# Altium project EPS 2023-24.PrjPcb
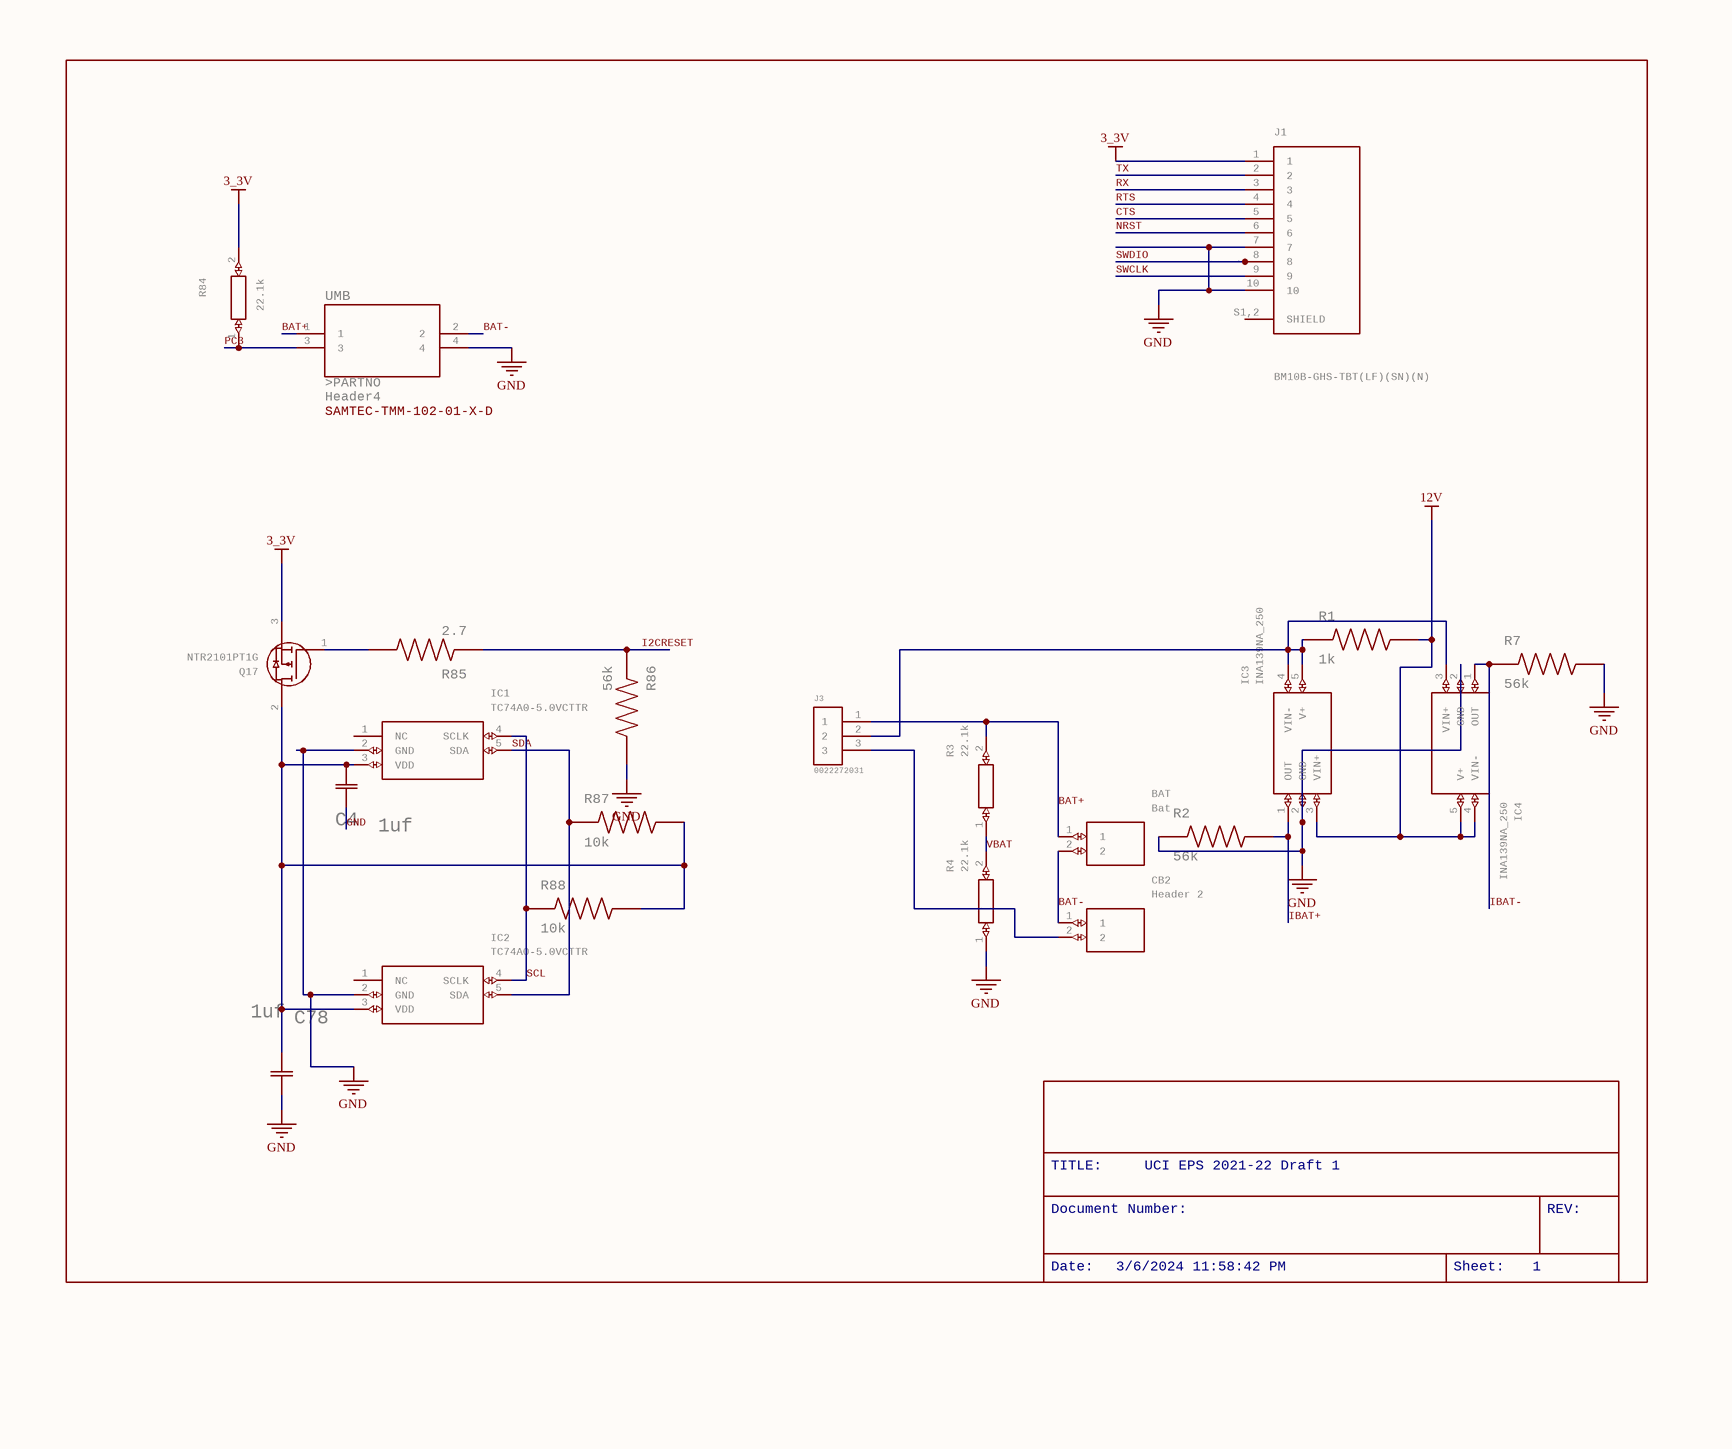
[diagram p0: EPS_Headers.SchDoc]
7 sheets, 258 parts. Net scope: flat (ports and power ports of the same name join across sheets).
Board file: EPS 2023-24.PcbDoc
Sheets:
  EPS_Headers.SchDoc
  SolarPanel_PowerGeneration.SchDoc
  Voltage_BypassCapacitors.SchDoc
  PAH_Deployments.SchDoc
  System_VoltageControl.SchDoc
  STM32_IO.SchDoc
  TEST_SchematicHierarchy.SchDoc

## Sheet EPS_Headers.SchDoc: UCI EPS 2021-22 Draft 1
size 304 x 254 mm; Origin: Eagle; Date: 3/6/2024 11:58:42 PM; SheetNumber: 1; GateName_1: G$1; SymbolName_1: FRAME_A_L; LibraryName: frames; DeviceSetName: FRAME_A_L; GateName_2: G$2; SymbolName_2: DOCFIELD; Sheet: Sheet:; REV: REV:

### Parts
BAT  Bat  [SHDR2W64P0X254_1X2_508X580X117]
C4  1uf  [YAG_CC0603_YAG-L]
C78  1uf  [YAG_CC0603_YAG]
CB2  Header 2  [SHDR2W64P0X254_1X2_508X580X117]
IC1  TC74A0-5.0VCTTR  [SOT95P280X145-5N]
IC2  TC74A0-5.0VCTTR  [SOT95P280X145-5N]
IC3  INA139NA_250  [SOT95P280X145-5N]
IC4  INA139NA_250  [SOT95P280X145-5N]
J1  BM10B-GHS-TBT(LF)(SN)(N)  [JST_BM10B-GHS-TBT(LF)(SN)(N)]
J3  0022272031  [MOLEX_0022272031]
Q17  NTR2101PT1G  [SOT96P237X111-3N]
R1  1k  [RESC1608X55N]
R2  56k  [RESC1608X55N]
R3  22.1k  [RESC1608X55N]
R4  22.1k  [RESC1608X55N]
R7  56k  [RESC1608X55N]
R84  22.1k  [RESC1608X55N]
R85  2.7  [RESC1608X55N]
R86  56k  [RESC1608X55N]
R87  10k  [RESC1608X55N]
R88  10k  [RESC1608X55N]
UMB  Header4  PARTNO: >PARTNO  [SAMTEC-TMM-102-01-X-D]

### Nets
3_3V: J1.1 Q17.3(D) R84.2
12V: IC3.3(VIN+) IC4.4(VIN-) IC4.5(V+) R1.2
GND: C4.1 C78.2 IC1.2(GND) IC2.2(GND) IC3.2(GND) IC4.2(GND) J1.7 J1.10 R2.1 R4.1 R7.2 R86.2 UMB.4  [project net BOTTOM]
BAT+: BAT.1 J3.1 R3.2 UMB.1  [project net BAT+_1]
BAT-: BAT.2 CB2.1 UMB.2  [project net BAT-_1]
CTS: J1.5  [project net CTS_1]
I2CRESET: R85.1 R86.1  [project net I2CRESET_1]
IBAT+: IC3.1(OUT) R2.2  [project net IBAT+_1]
IBAT-: IC4.1(OUT) R7.1  [project net IBAT-_1]
NRST: J1.6  [project net NRST_1]
PC3: R84.1 UMB.3  [project net PC3_1]
RTS: J1.4  [project net RTS_1]
RX: J1.3  [project net RX_1]
SCL: IC1.4(SCLK) IC2.4(SCLK) R88.1  [project net SCL_1]
SDA: IC1.5(SDA) IC2.5(SDA) R87.1  [project net SDA_1]
SWCLK: J1.9  [project net SWCLK_1]
SWDIO: J1.8  [project net SWDIO_1]
TX: J1.2  [project net TX_1]
VBAT: R3.1 R4.2  [project net VBAT_1]
NetC4_2: C4.2 C78.1 IC1.3(VDD) IC2.3(VDD) Q17.2(S) R87.2 R88.2
NetCB2_2: CB2.2 J3.3
NetIC3_4: IC3.4(VIN-) IC3.5(V+) IC4.3(VIN+) J3.2 R1.1
NetQ17_1: Q17.1(G) R85.2

Not connected (* = marked no-connect by the designer): IC1 1(NC); IC2 1(NC); J1 S1,2(SHIELD)

### Notes on the sheet
- TITLE:
- UCI EPS 2021-22 Draft 1
- Document Number:
- REV:
- Date:
- 3/6/2024 11:58:42 PM
- Sheet:
- 1

### Library data of the parts
BAT CB2 = 0022272021: Conn Wire to Board HDR 2 POS 2.54mm Solder ST Thru-Hole KK Bag   Source:  Datasheet; MANUFACTURER_NAME: Molex; GateName_1: G$1; SymbolName_1: 0022272021; LibraryName: header 2; DeviceSetName: 0022272021; ARROW_PART_NUMBER: 0022272021; ARROW_PRICE-STOCK: https://www.arrow.com/en/products/0022272021/molex; HEIGHT: 11.7mm; MANUFACTURER_PART_NUMBER: 0022272021; MOUSER_PART_NUMBER: N/A; MOUSER_PRICE-STOCK: https://www.mouser.co.uk/ProductDetail/Molex/0022272021?qs=PBcRNPEHKsoTuJ7eDXMaUA%3D%3D
C4 = CC0603KRX7R7BB105YAG_CC0603_YAG-L: GateName_1: A; SymbolName_1: CAPH; BUILT_BY: EMA_UL_Team; SOURCELIBRARY: Yageo_2014-12-31; VENDOR: Yageo; DeviceName: YAG_CC0603_YAG-L; LibraryName: Cap 1uf; DeviceSetName: CC0603KRX7R7BB105; MANUFACTURER_PART_NUMBER: CC0603KRX7R7BB105
C78 = CC0603KRX7R7BB105: GateName_1: A; SymbolName_1: CAPH; BUILT_BY: EMA_UL_Team; SOURCELIBRARY: Yageo_2014-12-31; VENDOR: Yageo; LibraryName: Cap 1uf; DeviceSetName: CC0603KRX7R7BB105; MANUFACTURER_PART_NUMBER: CC0603KRX7R7BB105
IC1 IC2 = TC74A0-5.0VCTTR: Serial Digital Thermal Sensor   Source:  Datasheet; MANUFACTURER_NAME: Microchip; GateName_1: G$1; SymbolName_1: TC74A0-5.0VCTTR; LibraryName: TC74A0-5.0VCTTR; DeviceSetName: TC74A0-5.0VCTTR; ARROW_PART_NUMBER: TC74A0-5.0VCTTR; ARROW_PRICE-STOCK: https://www.arrow.com/en/products/tc74a0-5.0vcttr/microchip-technology; HEIGHT: 1.45mm; MANUFACTURER_PART_NUMBER: TC74A0-5.0VCTTR; MOUSER_PART_NUMBER: 579-TC74A0-5.0VCTTR; MOUSER_PRICE-STOCK: https://www.mouser.co.uk/ProductDetail/Microchip-Technology/TC74A0-50VCTTR?qs=RnzODY3cU8u6j2kV6CfePA%3D%3D
IC3 IC4 = INA139NA_250: 36V, High-Side, High-Speed, Current Output Current Sense Amplifier   Source:  Datasheet; MANUFACTURER_NAME: Texas Instruments; MANUFACTURER_PART_NUMBER: INA139NA/250; GateName_1: G$1; SymbolName_1: INA139NA_250; LibraryName: INA139NA_250; DeviceSetName: INA139NA_250; ARROW_PART_NUMBER: INA139NA/250; ARROW_PRICE-STOCK: https://www.arrow.com/en/products/ina139na250/texas-instruments; HEIGHT: 1.45mm; MOUSER_PART_NUMBER: 595-INA139NA/250; MOUSER_PRICE-STOCK: https://www.mouser.co.uk/ProductDetail/Texas-Instruments/INA139NA-250?qs=VBduBm9rCJQSYOixXF05Zw%3D%3D
J1 = BM10B-GHS-TBT(LF)(SN)(N): Connector Header Surface Mount 10 position 0.049" (1.25mm) Check prices; GateName_1: G$1; MF: JST Sales; SymbolName_1: BM10B-GHS-TBT(LF)(SN)(N); LibraryName: BM10B-GHS-TBT_LF__SN__N_; DeviceSetName: BM10B-GHS-TBT(LF)(SN)(N); AVAILABILITY: Not in stock; MP: BM10B-GHS-TBT(LF)(SN)(N); PACKAGE: None; PRICE: None
J3 = 0022272031: CONN HEADER 3POS .100 VERT TIN Check prices; GateName_1: G$1; MF: Molex; SymbolName_1: 0022272031; LibraryName: header 3; DeviceSetName: 0022272031; AVAILABILITY: Good; MP: 0022272031; PACKAGE: None; PRICE: None
Q17 = NTR2101PT1G: Small Signal MOSFET   Source:  Datasheet; MANUFACTURER_NAME: ON Semiconductor; GateName_1: G$1; SymbolName_1: NTR2101PT1G; LibraryName: MOSFET-P; DeviceSetName: NTR2101PT1G; ARROW_PART_NUMBER: NTR2101PT1G; ARROW_PRICE-STOCK: https://www.arrow.com/en/products/ntr2101pt1g/on-semiconductor; HEIGHT: 1.11mm; MANUFACTURER_PART_NUMBER: NTR2101PT1G; MOUSER_PART_NUMBER: 863-NTR2101PT1G; MOUSER_PRICE-STOCK: https://www.mouser.co.uk/ProductDetail/ON-Semiconductor/NTR2101PT1G?qs=ZXBb0xZ9WeAElbwG%2FHcx4g%3D%3D
R1 = ERJ-PB3D1001V: Res Thick Film 0603 1K Ohm 5% 0.2W(1/5W) Â±50ppm/C Pad SMD Automotive T/R; GateName_1: G$1; MF: Panasonic; SymbolName_1: ERJ-PB3D1001V; LibraryName: Res1 1k; DeviceSetName: ERJ-PB3D1001V; DIGI-KEY_PART_NUMBER: P20283CT-ND; MP: ERJ-PB3D1001V; PACKAGE: 1608 Panasonic Electronic Components
R2 R7 R86 = ERJ-PB3D5602V: RES SMD 56K OHM 0.5% 1/5W 0603; GateName_1: G$1; MF: Panasonic; SymbolName_1: ERJ-PB3D5602V; LibraryName: Res1 56k; DeviceSetName: ERJ-PB3D5602V; DIGI-KEY_PART_NUMBER: DIGI-KEY_PART_NUMBER; MP: ERJ-PB3D5602V; PACKAGE: 1608 Panasonic Electronic Components
R3 R4 R84 = ERJPB3D2212V: hj   Source:  Datasheet; MANUFACTURER_NAME: Panasonic; GateName_1: G$1; SymbolName_1: ERJPB3D2212V; LibraryName: Res1-22.1k; DeviceSetName: ERJPB3D2212V; ARROW_PART_NUMBER: ARROW_PART_NUMBER; ARROW_PRICE-STOCK: ARROW_PRICE-STOCK; HEIGHT: 0.55mm; MANUFACTURER_PART_NUMBER: ERJPB3D2212V; MOUSER_PART_NUMBER: MOUSER_PART_NUMBER; MOUSER_PRICE-STOCK: MOUSER_PRICE-STOCK
R85 = RL0816S-2R7-F: GateName_1: G$1; MF: Susumu; SymbolName_1: RL0816S-2R7-F; LibraryName: Res1-2.7; DeviceSetName: RL0816S-2R7-F; DIGI-KEY_PART_NUMBER: DIGI-KEY_PART_NUMBER; MP: RL0816S-2R7-F; PACKAGE: 1608 Susumu
R87 R88 = ERJ-PB3D1002V: Res Thick Film 0603 10K Ohm 5% 0.2W(1/5W) Â±50ppm/C Pad SMD Automotive T/R; GateName_1: G$1; MF: Panasonic Electronic; SymbolName_1: ERJ-PB3D1002V; LibraryName: Res1 10k; DeviceSetName: ERJ-PB3D1002V; DIGI-KEY_PART_NUMBER: DIGI-KEY_PART_NUMBER; MP: ERJ-PB3D1002V; PACKAGE: 1608 Panasonic Electronic Components
UMB = SAMTEC-TMM-102-01-X-DJ: Check prices; GateName_1: A; SymbolName_1: SAMTEC-TMM-102-01-X-DA; DeviceName: J; MF: Samtec Inc.; MP: TMM-102-01-T-D; LibraryName: 4 pin header replace; DeviceSetName: SAMTEC-TMM-102-01-X-D; SAMTEC-TMM-102-01-X-D: SAMTEC-TMM-102-01-X-D; AVAILABILITY: In Stock; PACKAGE: None; PRICE: None; PURCHASE-URL: https://pricing.snapeda.com/search/part/TMM-102-01-T-D/?ref=eda

## Sheet SolarPanel_PowerGeneration.SchDoc
size 690 x 406 mm; Origin: Eagle
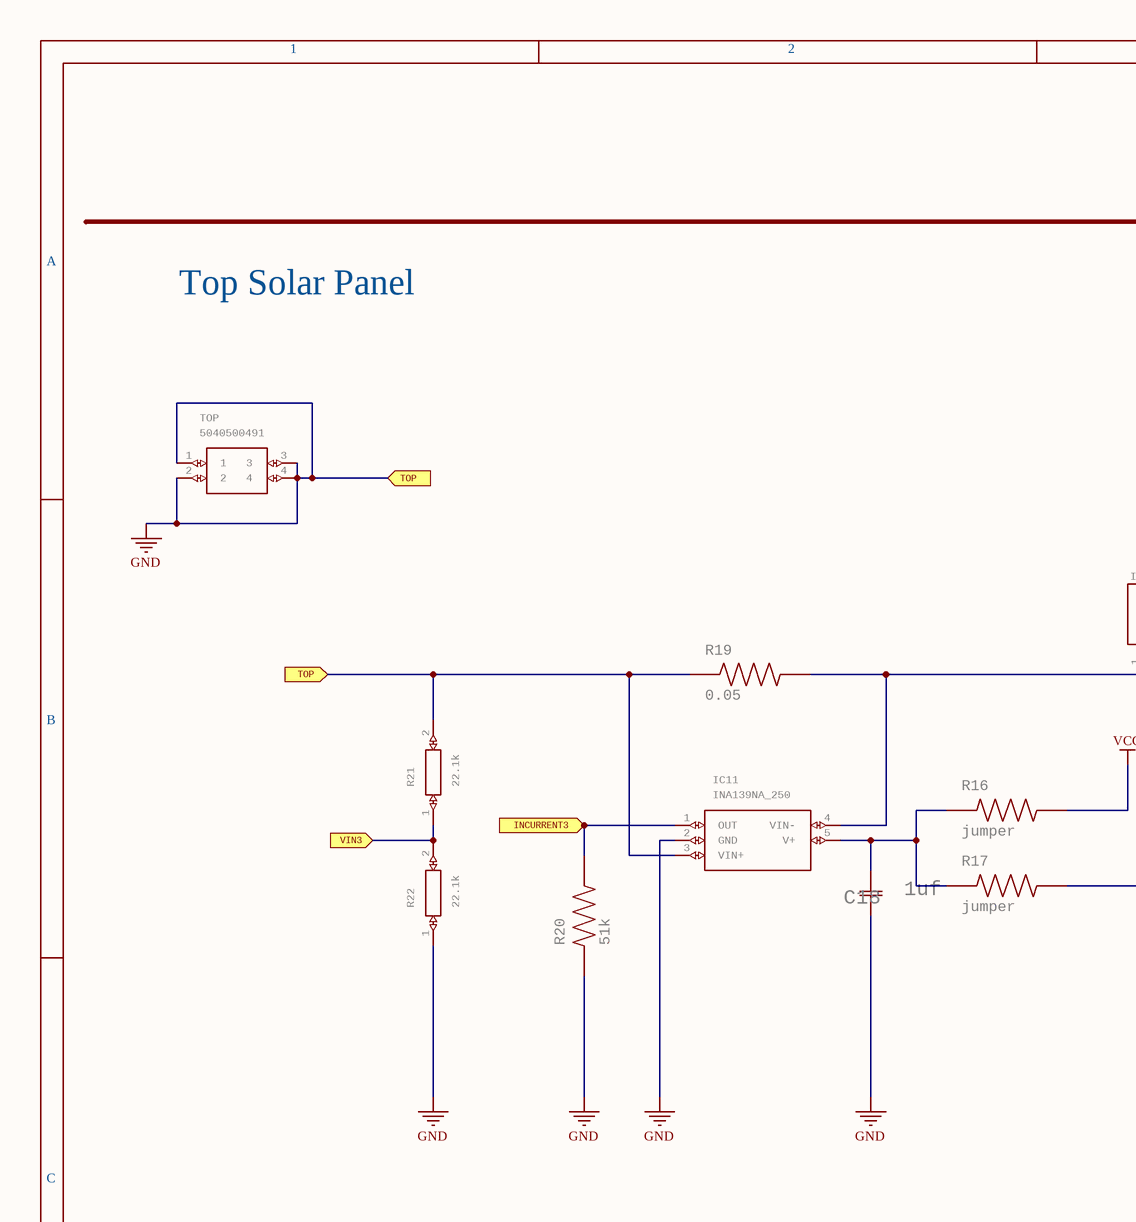
[diagram p1: SolarPanel_PowerGeneration.SchDoc, top left]
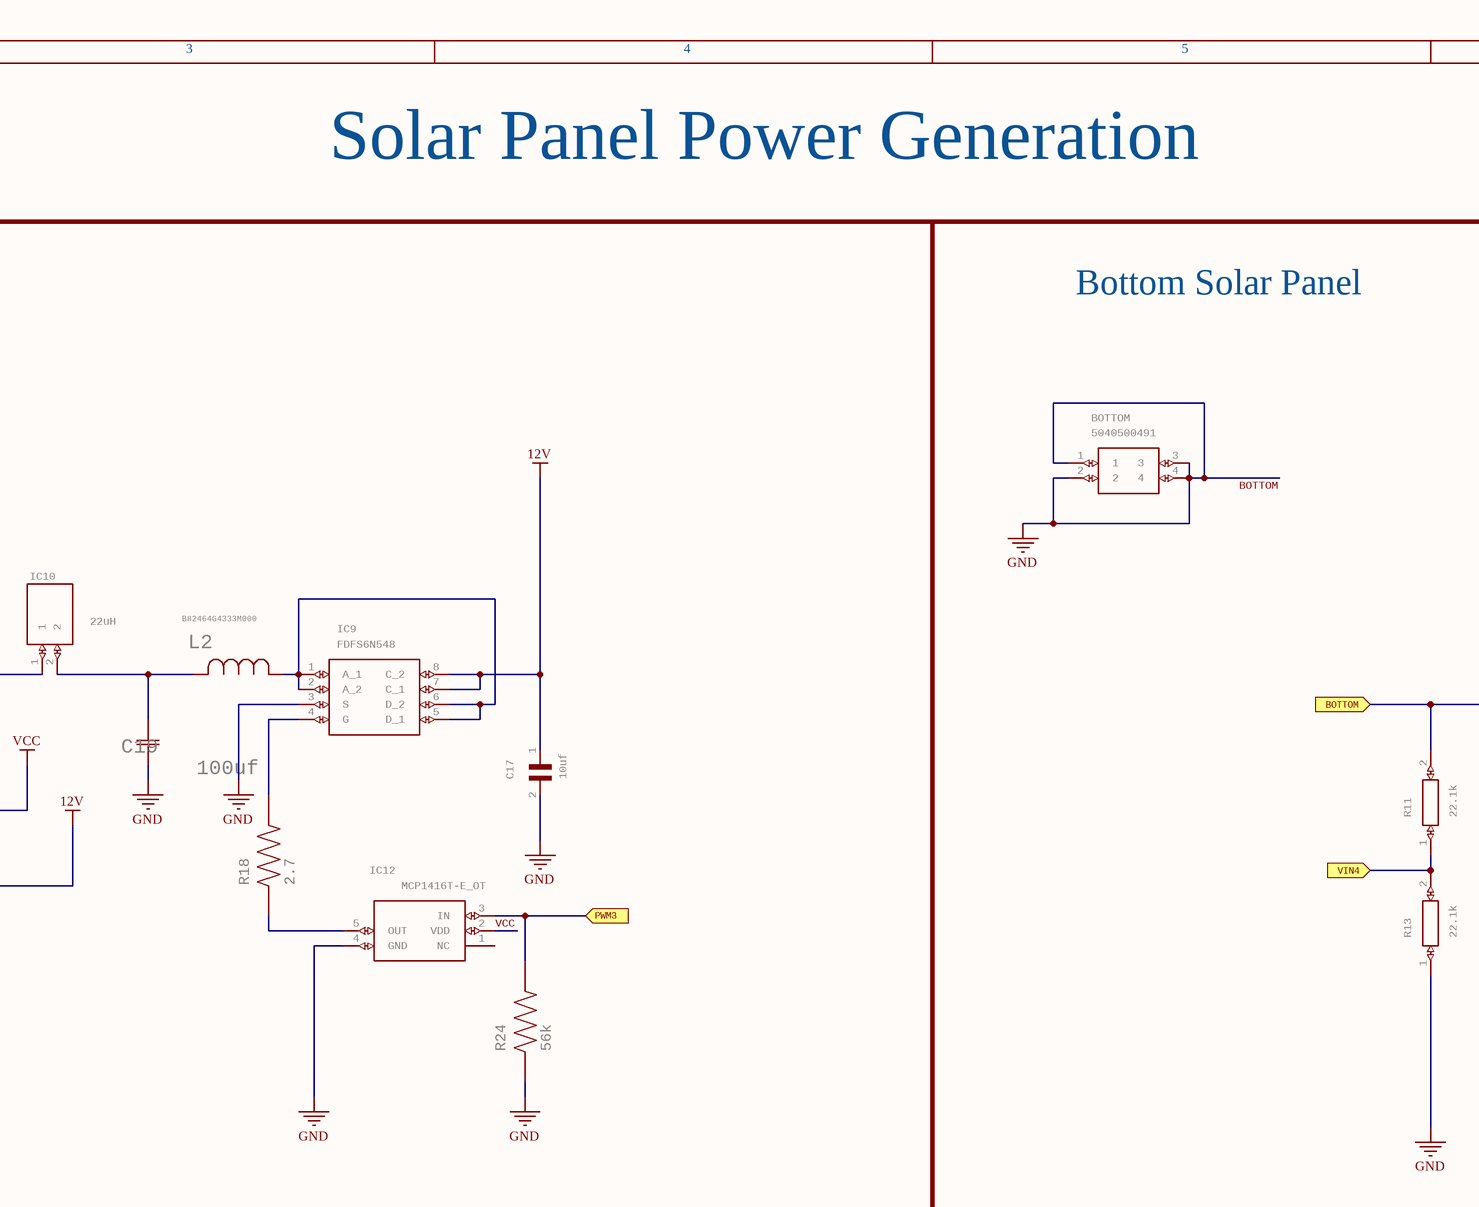
[diagram p2: SolarPanel_PowerGeneration.SchDoc, top middle]
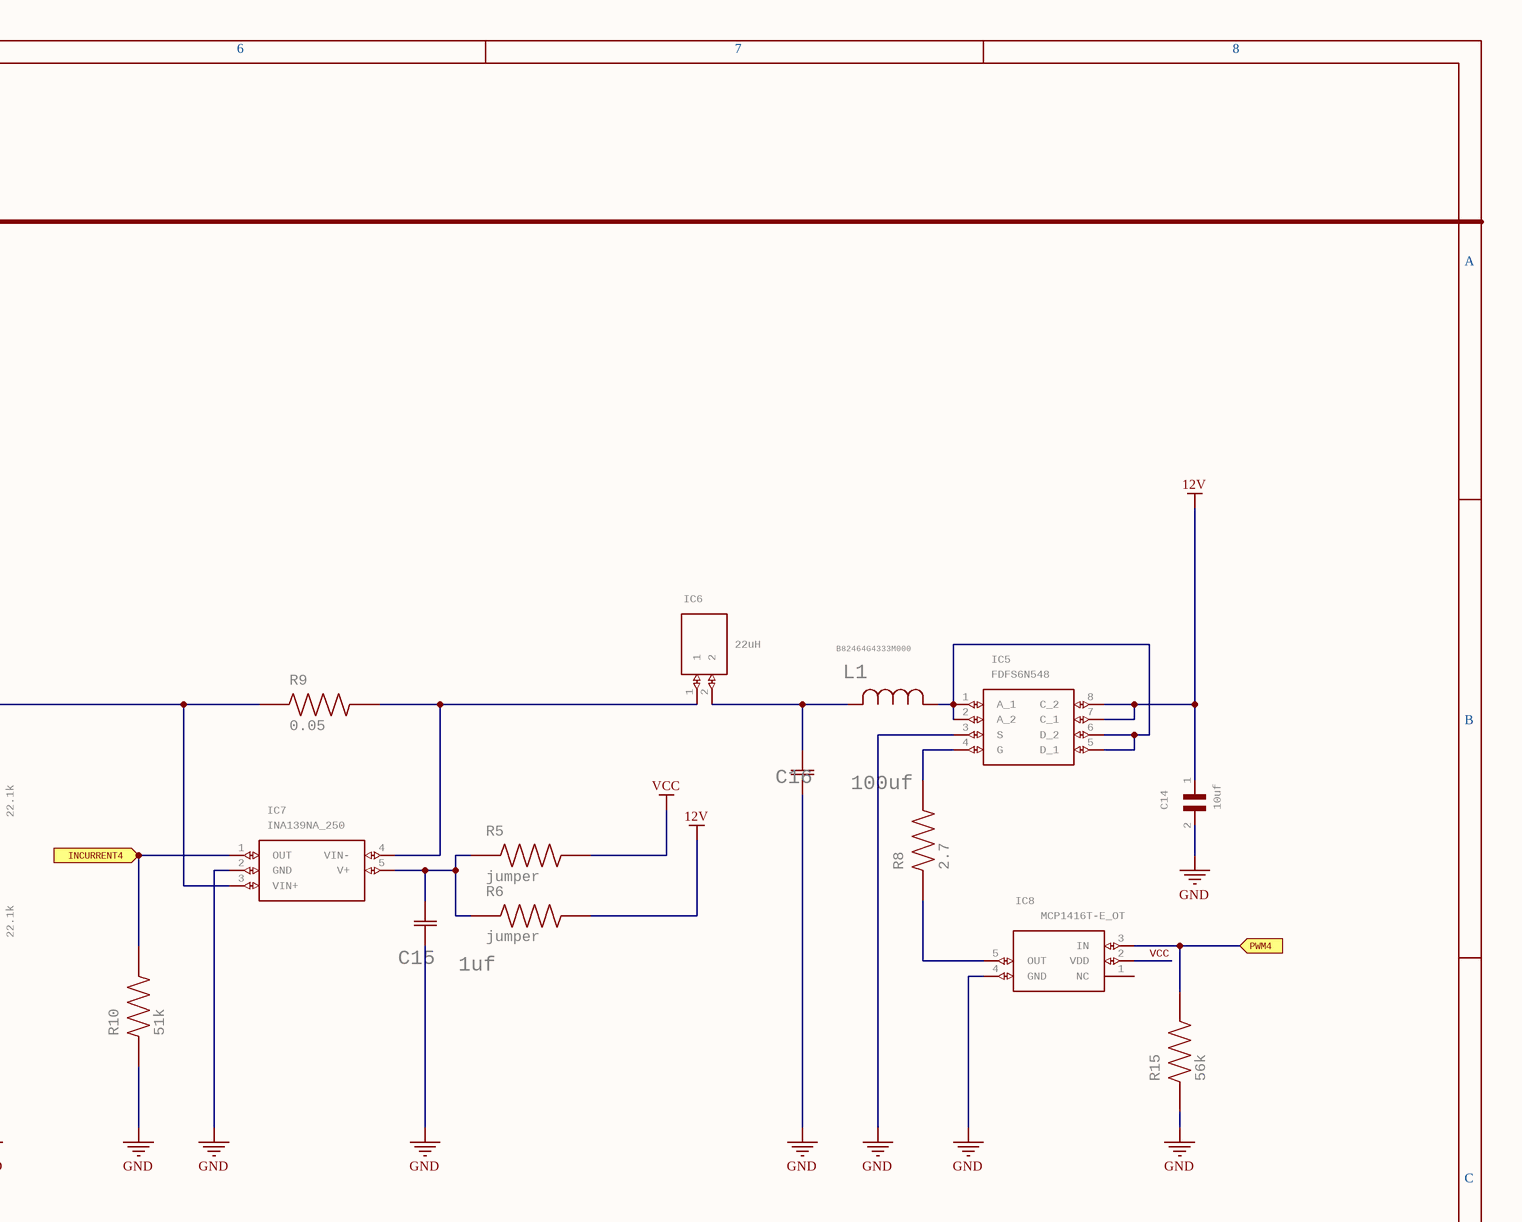
[diagram p3: SolarPanel_PowerGeneration.SchDoc, top right]
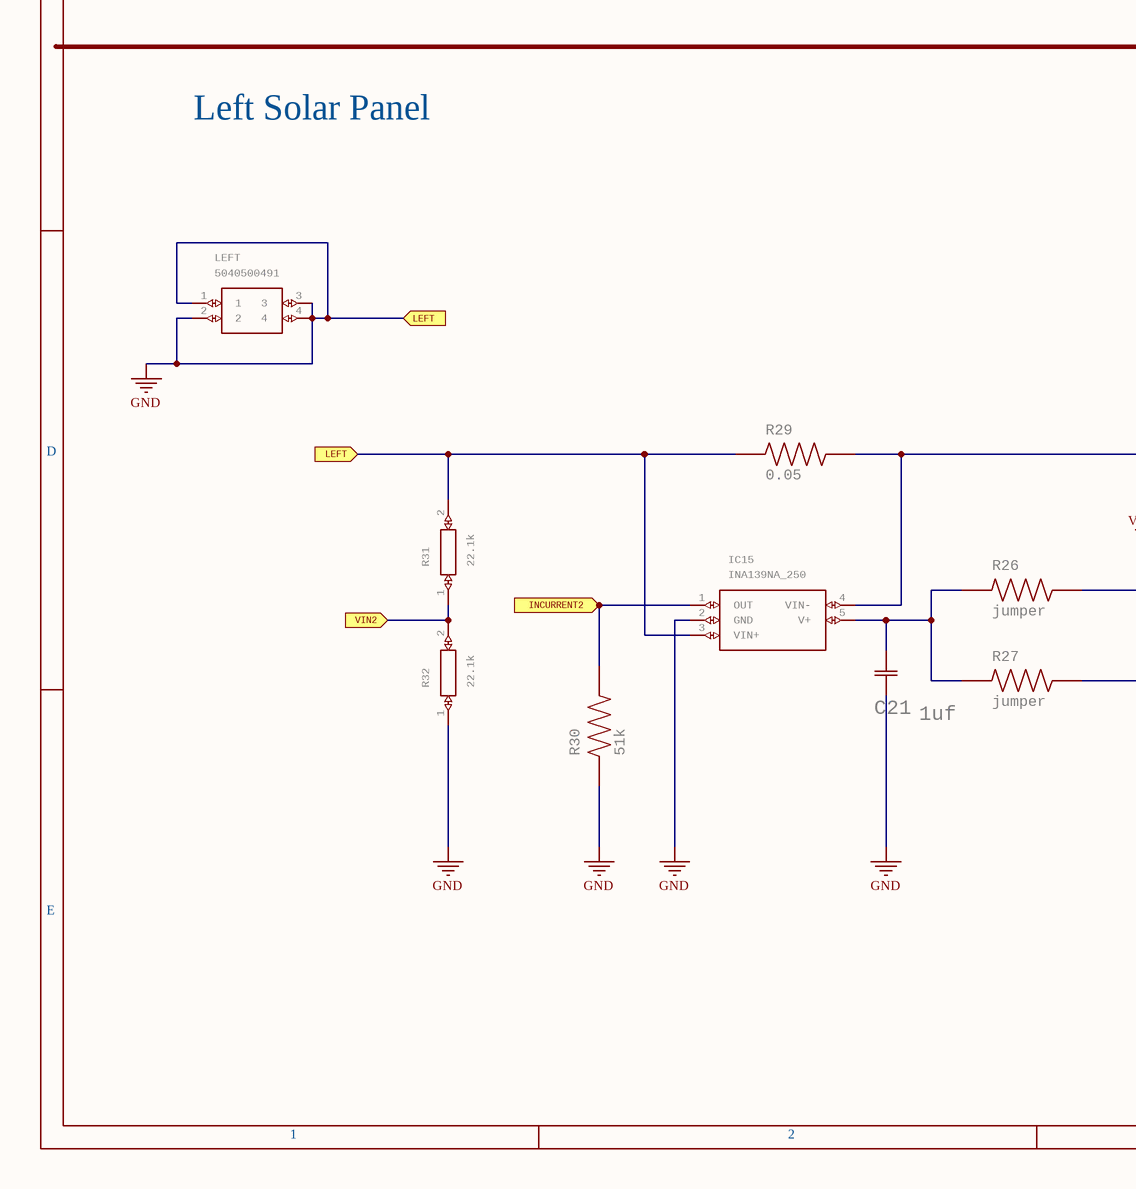
[diagram p4: SolarPanel_PowerGeneration.SchDoc, bottom left]
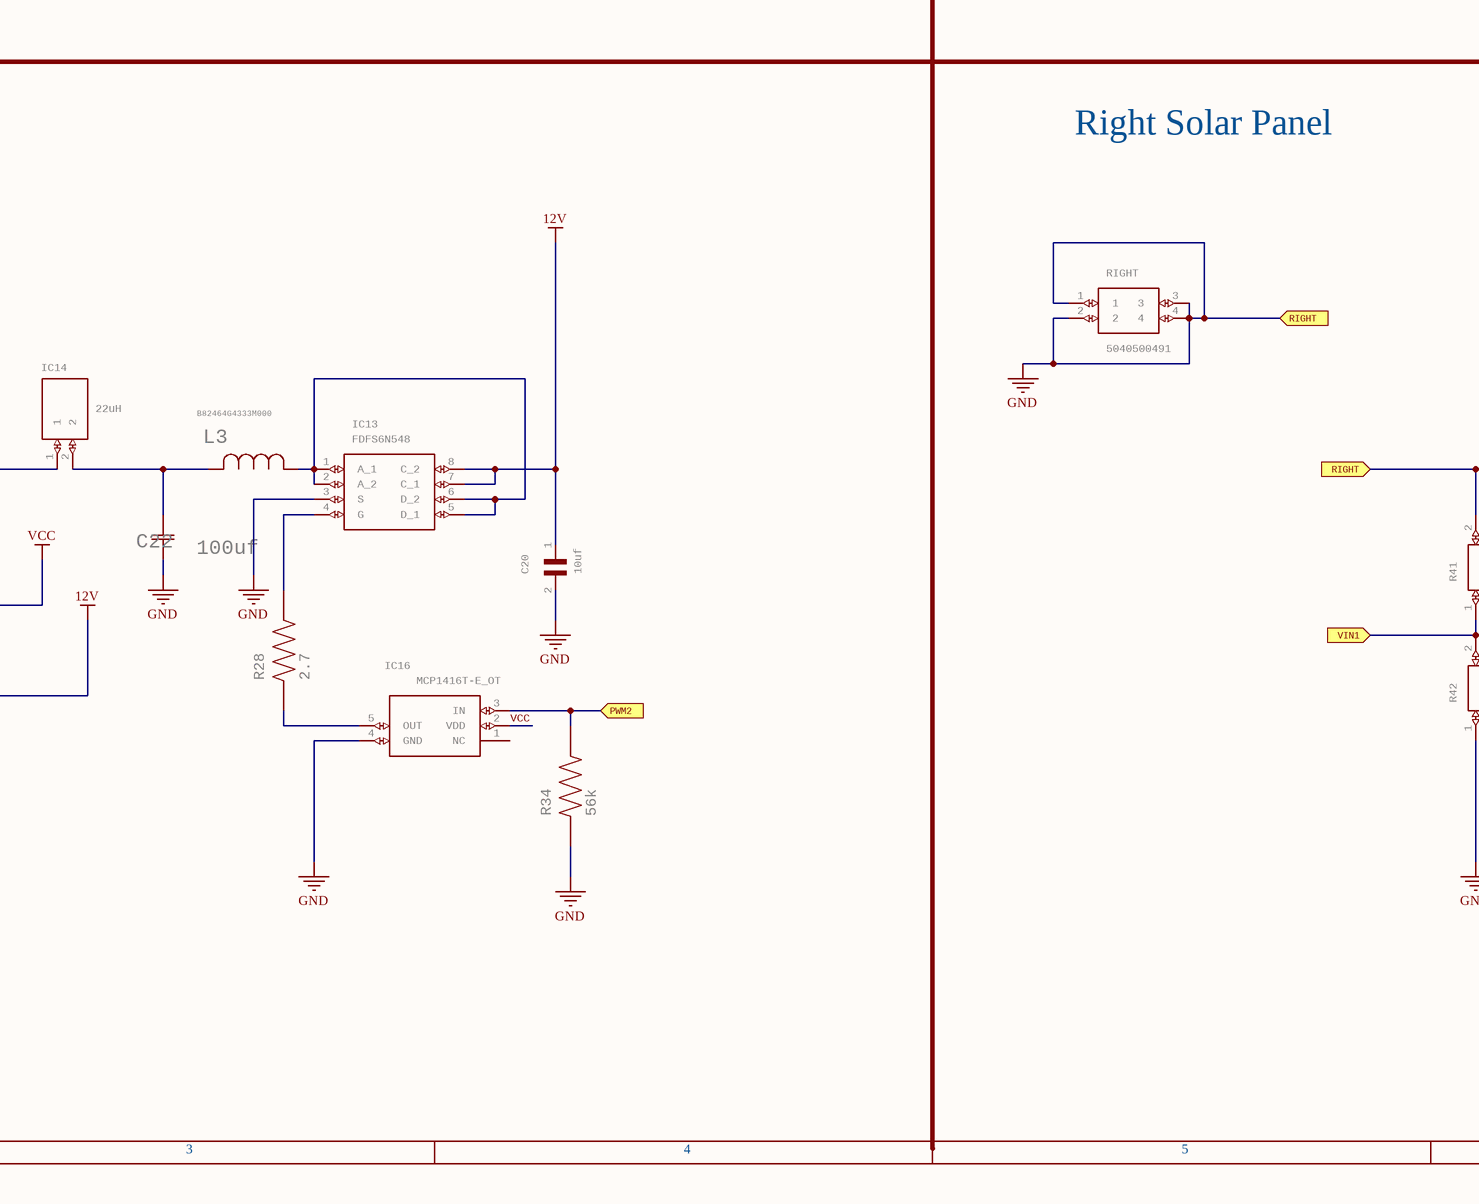
[diagram p5: SolarPanel_PowerGeneration.SchDoc, bottom middle]
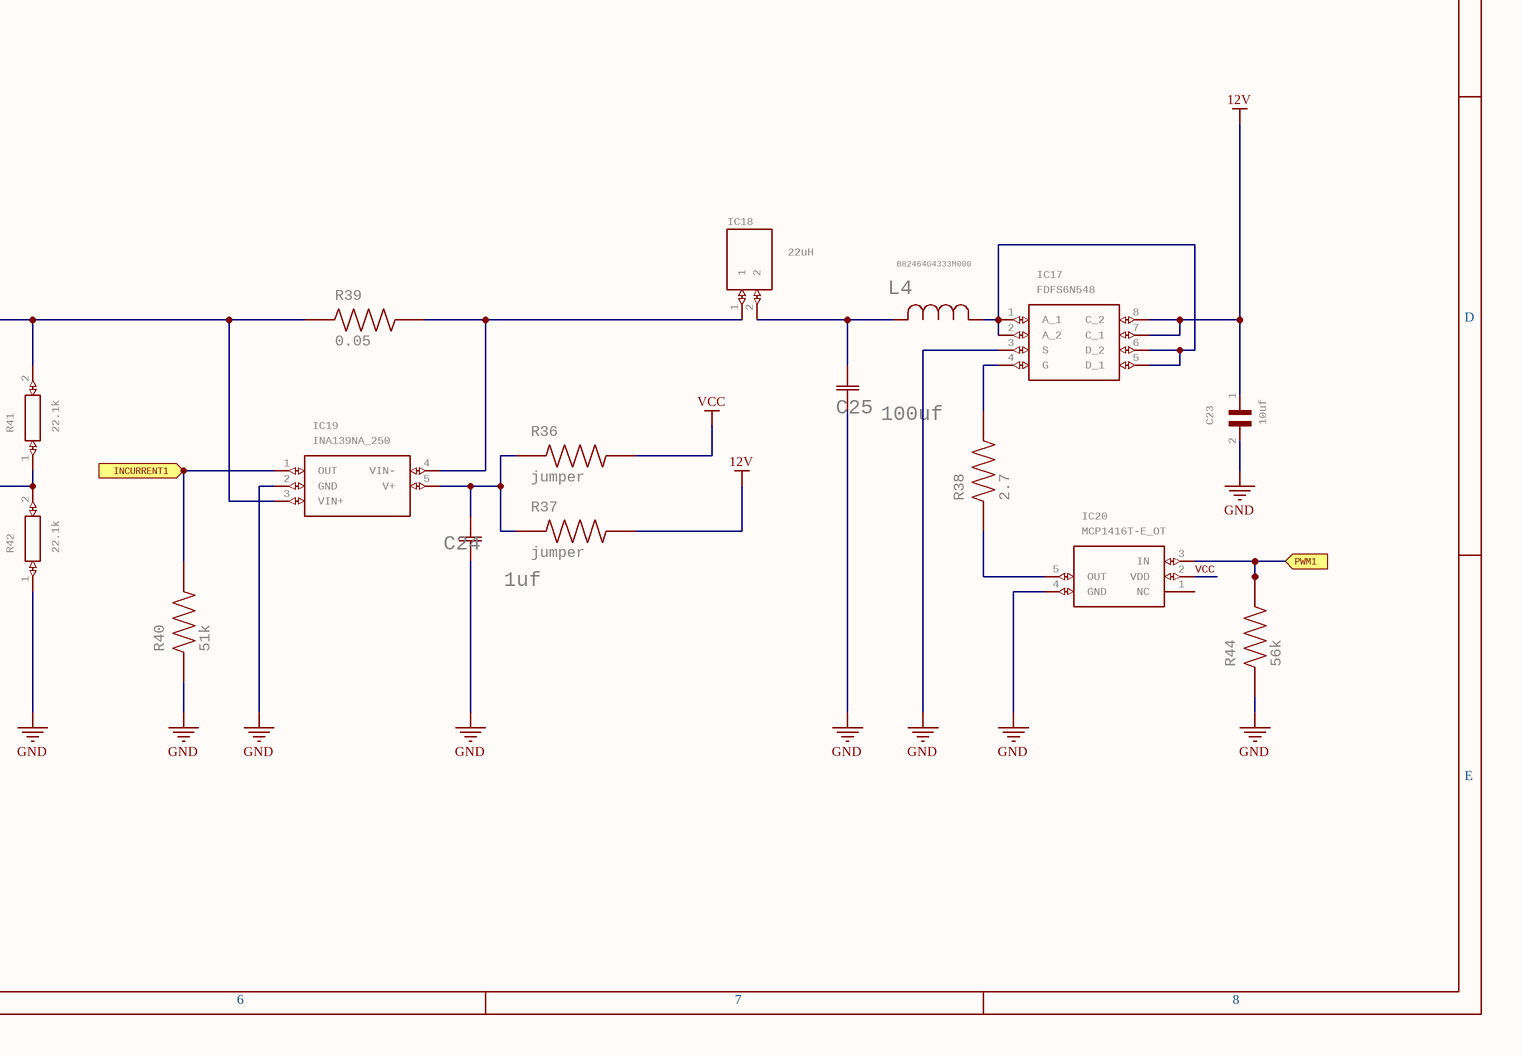
[diagram p6: SolarPanel_PowerGeneration.SchDoc, bottom right]

### Parts
BOTTOM  5040500491  [5040500491]
C14  10uf  [CAPC2012X70]
C15  1uf  [YAG_CC0603_YAG]
C16  100uf  [CAP_CC1210_YAG]
C17  10uf  [CAPC2012X70]
C18  1uf  [YAG_CC0603_YAG]
C19  100uf  [CAP_CC1210_YAG]
C20  10uf  [CAPC2012X70]
C21  1uf  [YAG_CC0603_YAG]
C22  100uf  [CAP_CC1210_YAG]
C23  10uf  [CAPC2012X70]
C24  1uf  [YAG_CC0603_YAG]
C25  100uf  [CAP_CC1210_YAG]
IC5  FDFS6N548  [SOIC127P600X175-8N]
IC6  22uH  [SRU8043220Y]
IC7  INA139NA_250  [SOT95P280X145-5N]
IC8  MCP1416T-E_OT  [SOT95P270X145-5N]
IC9  FDFS6N548  [SOIC127P600X175-8N]
IC10  22uH  [SRU8043220Y]
IC11  INA139NA_250  [SOT95P280X145-5N]
IC12  MCP1416T-E_OT  [SOT95P270X145-5N]
IC13  FDFS6N548  [SOIC127P600X175-8N]
IC14  22uH  [SRU8043220Y]
IC15  INA139NA_250  [SOT95P280X145-5N]
IC16  MCP1416T-E_OT  [SOT95P270X145-5N]
IC17  FDFS6N548  [SOIC127P600X175-8N]
IC18  22uH  [SRU8043220Y]
IC19  INA139NA_250  [SOT95P280X145-5N]
IC20  MCP1416T-E_OT  [SOT95P270X145-5N]
L1  B82464G4333M000  [IND_B82464G4_EPC]
L2  B82464G4333M000  [IND_B82464G4_EPC]
L3  B82464G4333M000  [IND_B82464G4_EPC]
L4  B82464G4333M000  [IND_B82464G4_EPC]
LEFT  5040500491  [5040500491]
R5  jumper  [RESC1508X50N]
R6  jumper  [RESC1508X50N]
R8  2.7  [RESC1608X55N]
R9  0.05  [RESC1608X55N]
R10  51k  [RESC1608X55N]
R11  22.1k  [RESC1608X55N]
R13  22.1k  [RESC1608X55N]
R15  56k  [RESC1608X55N]
R16  jumper  [RESC1508X50N]
R17  jumper  [RESC1508X50N]
R18  2.7  [RESC1608X55N]
R19  0.05  [RESC1608X55N]
R20  51k  [RESC1608X55N]
R21  22.1k  [RESC1608X55N]
R22  22.1k  [RESC1608X55N]
R24  56k  [RESC1608X55N]
R26  jumper  [RESC1508X50N]
R27  jumper  [RESC1508X50N]
R28  2.7  [RESC1608X55N]
R29  0.05  [RESC1608X55N]
R30  51k  [RESC1608X55N]
R31  22.1k  [RESC1608X55N]
R32  22.1k  [RESC1608X55N]
R34  56k  [RESC1608X55N]
R36  jumper  [RESC1508X50N]
R37  jumper  [RESC1508X50N]
R38  2.7  [RESC1608X55N]
R39  0.05  [RESC1608X55N]
R40  51k  [RESC1608X55N]
R41  22.1k  [RESC1608X55N]
R42  22.1k  [RESC1608X55N]
R44  56k  [RESC1608X55N]
RIGHT  5040500491  [5040500491]
TOP  5040500491  [5040500491]

### Ports
BOTTOM (in), INCURRENT1 (in), INCURRENT2 (in), INCURRENT3 (in), INCURRENT4 (in), LEFT (in), PWM1 (in), PWM2 (in), PWM3 (in), PWM4 (in), RIGHT (in), TOP (in), VIN1 (in), VIN2 (in), VIN3 (in), VIN4 (in)

### Nets
12V: C14.1 C17.1 C20.1 C23.1 IC5.7(C_1) IC5.8(C_2) IC9.7(C_1) IC9.8(C_2) IC13.7(C_1) IC13.8(C_2) IC17.7(C_1) IC17.8(C_2) R6.2 R17.2 R27.2 R37.2
BOTTOM: BOTTOM.1 BOTTOM.2 BOTTOM.3 BOTTOM.4 C14.2 C15.1 C16.1 C17.2 C18.1 C19.1 C20.2 C21.1 C22.1 C23.2 C24.1 C25.1 IC5.3(S) IC7.2(GND) IC8.4(GND) IC9.3(S) IC11.2(GND) IC11.3(VIN+) IC12.4(GND) IC13.3(S) IC15.2(GND) IC15.3(VIN+) IC16.4(GND) IC17.3(S) IC19.2(GND) IC19.3(VIN+) IC20.4(GND) LEFT.1 LEFT.2 LEFT.3 LEFT.4 R10.1 R13.1 R15.1 R19.1 R20.1 R21.2 R22.1 R24.1 R29.1 R30.1 R31.2 R32.1 R34.1 R39.1 R40.1 R41.2 R42.1 R44.1 RIGHT.1 RIGHT.2 RIGHT.3 RIGHT.4 TOP.1 TOP.2 TOP.3 TOP.4 ; port LEFT, port RIGHT, port TOP  [also labelled GND]
VCC: IC8.2(VDD) IC12.2(VDD) IC16.2(VDD) IC20.2(VDD) R5.2 R16.2 R26.2 R36.2
BOTTOM: IC7.3(VIN+) R9.1 R11.2 ; port BOTTOM  [a separate net that carries the same name]
INCURRENT1: IC19.1(OUT) R40.2 ; port INCURRENT1
INCURRENT2: IC15.1(OUT) R30.2 ; port INCURRENT2
INCURRENT3: IC11.1(OUT) R20.2 ; port INCURRENT3
INCURRENT4: IC7.1(OUT) R10.2 ; port INCURRENT4
PWM1: IC20.3(IN) R44.2 ; port PWM1
PWM2: IC16.3(IN) R34.2 ; port PWM2
PWM3: IC12.3(IN) R24.2 ; port PWM3
PWM4: IC8.3(IN) R15.2 ; port PWM4
VIN1: R41.1 R42.2 ; port VIN1
VIN2: R31.1 R32.2 ; port VIN2
VIN3: R21.1 R22.2 ; port VIN3
VIN4: R11.1 R13.2 ; port VIN4
NetC15_2: C15.2 IC7.5(V+) R5.1 R6.1
NetC16_2: C16.2 IC6.2 L1.2
NetC18_2: C18.2 IC11.5(V+) R16.1 R17.1
NetC19_2: C19.2 IC10.2 L2.2
NetC21_2: C21.2 IC15.5(V+) R26.1 R27.1
NetC22_2: C22.2 IC14.2 L3.2
NetC24_2: C24.2 IC19.5(V+) R36.1 R37.1
NetC25_2: C25.2 IC18.2 L4.2
NetIC5_1: IC5.1(A_1) IC5.2(A_2) IC5.5(D_1) IC5.6(D_2) L1.1
NetIC5_4: IC5.4(G) R8.2
NetIC6_1: IC6.1 IC7.4(VIN-) R9.2
NetIC8_5: IC8.5(OUT) R8.1
NetIC9_1: IC9.1(A_1) IC9.2(A_2) IC9.5(D_1) IC9.6(D_2) L2.1
NetIC9_4: IC9.4(G) R18.2
NetIC10_1: IC10.1 IC11.4(VIN-) R19.2
NetIC12_5: IC12.5(OUT) R18.1
NetIC13_1: IC13.1(A_1) IC13.2(A_2) IC13.5(D_1) IC13.6(D_2) L3.1
NetIC13_4: IC13.4(G) R28.2
NetIC14_1: IC14.1 IC15.4(VIN-) R29.2
NetIC16_5: IC16.5(OUT) R28.1
NetIC17_1: IC17.1(A_1) IC17.2(A_2) IC17.5(D_1) IC17.6(D_2) L4.1
NetIC17_4: IC17.4(G) R38.2
NetIC18_1: IC18.1 IC19.4(VIN-) R39.2
NetIC20_5: IC20.5(OUT) R38.1

Not connected (* = marked no-connect by the designer): IC8 1(NC); IC12 1(NC); IC16 1(NC); IC20 1(NC)

### Notes on the sheet
- 1
- 2
- 3
- 4
- 5
- 6
- 7
- 8
- Solar Panel Power Generation
- A
- Top Solar Panel
- Bottom Solar Panel
- B
- C
- Left Solar Panel
- Right Solar Panel
- D
- E

### Library data of the parts
BOTTOM LEFT RIGHT TOP = 5040500491: 1.50mm Pitch, Pico-Lock PCB Header, Single Row, Right-Angle, Surface Mount, Gold (Au) Plating, Positive Lock, 4 Circuits, Tape and Reel   Source:  Datasheet; MANUFACTURER_NAME: Molex; GateName_1: G$1; SymbolName_1: 5040500491; LibraryName: Molex Picolock 4pos; DeviceSetName: 5040500491; ARROW_PART_NUMBER: 5040500491; ARROW_PRICE-STOCK: https://www.arrow.com/en/products/5040500491/molex; HEIGHT: 2mm; MANUFACTURER_PART_NUMBER: 5040500491; MOUSER_PART_NUMBER: MOUSER_PART_NUMBER; MOUSER_PRICE-STOCK: MOUSER_PRICE-STOCK
C14 C17 C20 C23 = CC0805KKX5R7BB106: KC 10ÂµF 0805 10% 16V X5R; GateName_1: G$1; MF: Yageo; SymbolName_1: CC0805KKX5R7BB106; LibraryName: Cap 10uf; DeviceSetName: CC0805KKX5R7BB106; DIGI-KEY_PART_NUMBER: 311-1865-1-ND; MP: CC0805KKX5R7BB106; PACKAGE: 0805 Yageo
C15 C18 C21 C24 = CC0603KRX7R7BB105: as C78 on sheet EPS_Headers; LibraryName: Cap 1uf; DeviceSetName: CC0603KRX7R7BB105; MANUFACTURER_PART_NUMBER: CC0603KRX7R7BB105
C16 C19 C22 C25 = CC1210MKX5R5BB107: GateName_1: A; SymbolName_1: CAPH; BUILT_BY: EMA_Justin; SOURCELIBRARY: Add_to_database_2021-05-13; VENDOR: Yageo; LibraryName: Cap 100uf 6.3v; DeviceSetName: CC1210MKX5R5BB107; COPYRIGHT: Copyright (C) 2018 Accelerated Designs. All rights reserved; DATASHEET: https://www.mouser.com/datasheet/2/447/UPY_GP_NP0_16V_to_50V_18-1730511.pdf; MANUFACTURER_PART_NUMBER: CC1210MKX5R5BB107
IC5 IC9 IC13 IC17 = FDFS6N548: MOSFET N-Channel 30V 7A +Schottky SOIC8 Fairchild FDFS6N548 N-channel MOSFET Transistor, 7 A, 30 V, 8-Pin SO   Source:  Datasheet; MANUFACTURER_NAME: ON Semiconductor; GateName_1: G$1; SymbolName_1: FDFS6N548; LibraryName: FDFS6N548; DeviceSetName: FDFS6N548; ARROW_PART_NUMBER: FDFS6N548; ARROW_PRICE-STOCK: https://www.arrow.com/en/products/fdfs6n548/on-semiconductor; HEIGHT: 1.75mm; MANUFACTURER_PART_NUMBER: FDFS6N548; MOUSER_PART_NUMBER: 512-FDFS6N548; MOUSER_PRICE-STOCK: https://www.mouser.co.uk/ProductDetail/ON-Semiconductor-Fairchild/FDFS6N548?qs=b4rH2LiNnwlqgZ%2FZIEc2ow%3D%3D
IC6 IC10 IC14 IC18 = SRU8043-220Y: Bourns SRU6043 Series Shielded Wire-wound SMD Inductor with a Ferrite Core, 22 uH +/-30% Wire-Wound Q:24   Source:  Datasheet; GateName_1: G$1; SymbolName_1: SRU8043-220Y; LibraryName: SRU8043-220Y; DeviceSetName: SRU8043-220Y; ARROW_PART_NUMBER: SRU8043-220Y; ARROW_PRICE-STOCK: https://www.arrow.com/en/products/sru8043-220y/bourns; HEIGHT: 4.6mm; MANUFACTURER_NAME: Bourns; MANUFACTURER_PART_NUMBER: SRU8043-220Y; MOUSER_PART_NUMBER: 652-SRU8043-220Y; MOUSER_PRICE-STOCK: https://www.mouser.co.uk/ProductDetail/Bourns/SRU8043-220Y?qs=3fQS%252B%2FKBkgzsqu9QDdXSwQ%3D%3D
IC7 IC11 IC15 IC19 = INA139NA_250: as IC3 on sheet EPS_Headers; SymbolName_1: INA139NA_250; LibraryName: INA139NA_250; DeviceSetName: INA139NA_250; ARROW_PART_NUMBER: INA139NA/250; ARROW_PRICE-STOCK: https://www.arrow.com/en/products/ina139na250/texas-instruments; HEIGHT: 1.45mm; MOUSER_PART_NUMBER: 595-INA139NA/250; MOUSER_PRICE-STOCK: https://www.mouser.co.uk/ProductDetail/Texas-Instruments/INA139NA-250?qs=VBduBm9rCJQSYOixXF05Zw%3D%3D
IC8 IC12 IC16 IC20 = MCP1416T-E_OT: MOSFET Driver 1.5A High-Speed 18V SOT23   Source:  Datasheet; MANUFACTURER_NAME: Microchip; MANUFACTURER_PART_NUMBER: MCP1416T-E/OT; GateName_1: G$1; SymbolName_1: MCP1416T-E_OT; LibraryName: MCP1416T-E_OT; DeviceSetName: MCP1416T-E_OT; ARROW_PART_NUMBER: MCP1416T-E/OT; ARROW_PRICE-STOCK: https://www.arrow.com/en/products/mcp1416t-eot/microchip-technology; HEIGHT: 1.45mm; MOUSER_PART_NUMBER: 579-MCP1416T-E/OT; MOUSER_PRICE-STOCK: https://www.mouser.co.uk/ProductDetail/Microchip-Technology/MCP1416T-E-OT?qs=hH%252BOa0VZEiBT%252BgAjATFU6A%3D%3D
L1-L4 = B82464G4333M000: GateName_1: A; SymbolName_1: IND; BUILT_BY: EMA_UL_Team; SOURCELIBRARY: Epcos_2010-01-01_IND_B82464G4; VENDOR: Epcos; LibraryName: B82464G4333M; DeviceSetName: B82464G4333M000; MANUFACTURER_PART_NUMBER: B82464G4333M000
R5 R6 R16 R17 R26 R27 R36 R37 = CRCW06030000ZSTB: RES SMD 0 OHM JUMPER 1/10W 0603; GateName_1: G$1; MF: Vishay Dale; SymbolName_1: CRCW06030000ZSTB; LibraryName: Jumper; DeviceSetName: CRCW06030000ZSTB; DIGI-KEY_PART_NUMBER: DIGI-KEY_PART_NUMBER; MP: CRCW06030000ZSTB; PACKAGE: 1508 Vishay
R8 R18 R28 R38 = RL0816S-2R7-F: GateName_1: G$1; MF: Susumu; SymbolName_1: RL0816S-2R7-F; LibraryName: Res1-2.7; DeviceSetName: RL0816S-2R7-F; DIGI-KEY_PART_NUMBER: DIGI-KEY_PART_NUMBER; MP: RL0816S-2R7-F; PACKAGE: 1608 Susumu
R9 R19 R29 R39 = ERJ-L03KJ50MV: RES SMD 0.05 OHM 5% 1/5W 0603; GateName_1: G$1; MF: Panasonic; SymbolName_1: ERJ-L03KJ50MV; LibraryName: Res1 0.05; DeviceSetName: ERJ-L03KJ50MV; DIGI-KEY_PART_NUMBER: P50NJCT-ND; MP: ERJ-L03KJ50MV; PACKAGE: 1608-2 Panasonic
R10 R20 R30 R40 = ERJ-PB3D5102V: RES SMD 51K OHM 0.5% 1/5W 0603; GateName_1: G$1; MF: Panasonic; SymbolName_1: ERJ-PB3D5102V; LibraryName: Res1 51k; DeviceSetName: ERJ-PB3D5102V; DIGI-KEY_PART_NUMBER: DIGI-KEY_PART_NUMBER; MP: ERJ-PB3D5102V; PACKAGE: 1608 Panasonic Electronic Components
R11 R13 R21 R22 R31 R32 R41 R42 = ERJPB3D2212V: as R3 on sheet EPS_Headers; SymbolName_1: ERJPB3D2212V; LibraryName: Res1-22.1k; DeviceSetName: ERJPB3D2212V; ARROW_PART_NUMBER: ARROW_PART_NUMBER; ARROW_PRICE-STOCK: ARROW_PRICE-STOCK; HEIGHT: 0.55mm; MANUFACTURER_PART_NUMBER: ERJPB3D2212V; MOUSER_PART_NUMBER: MOUSER_PART_NUMBER; MOUSER_PRICE-STOCK: MOUSER_PRICE-STOCK
R15 R24 R34 R44 = ERJ-PB3D5602V: as R2 on sheet EPS_Headers; SymbolName_1: ERJ-PB3D5602V; LibraryName: Res1 56k; DeviceSetName: ERJ-PB3D5602V; DIGI-KEY_PART_NUMBER: DIGI-KEY_PART_NUMBER; MP: ERJ-PB3D5602V; PACKAGE: 1608 Panasonic Electronic Components

## Sheet Voltage_BypassCapacitors.SchDoc
size 287 x 147 mm; Origin: Eagle
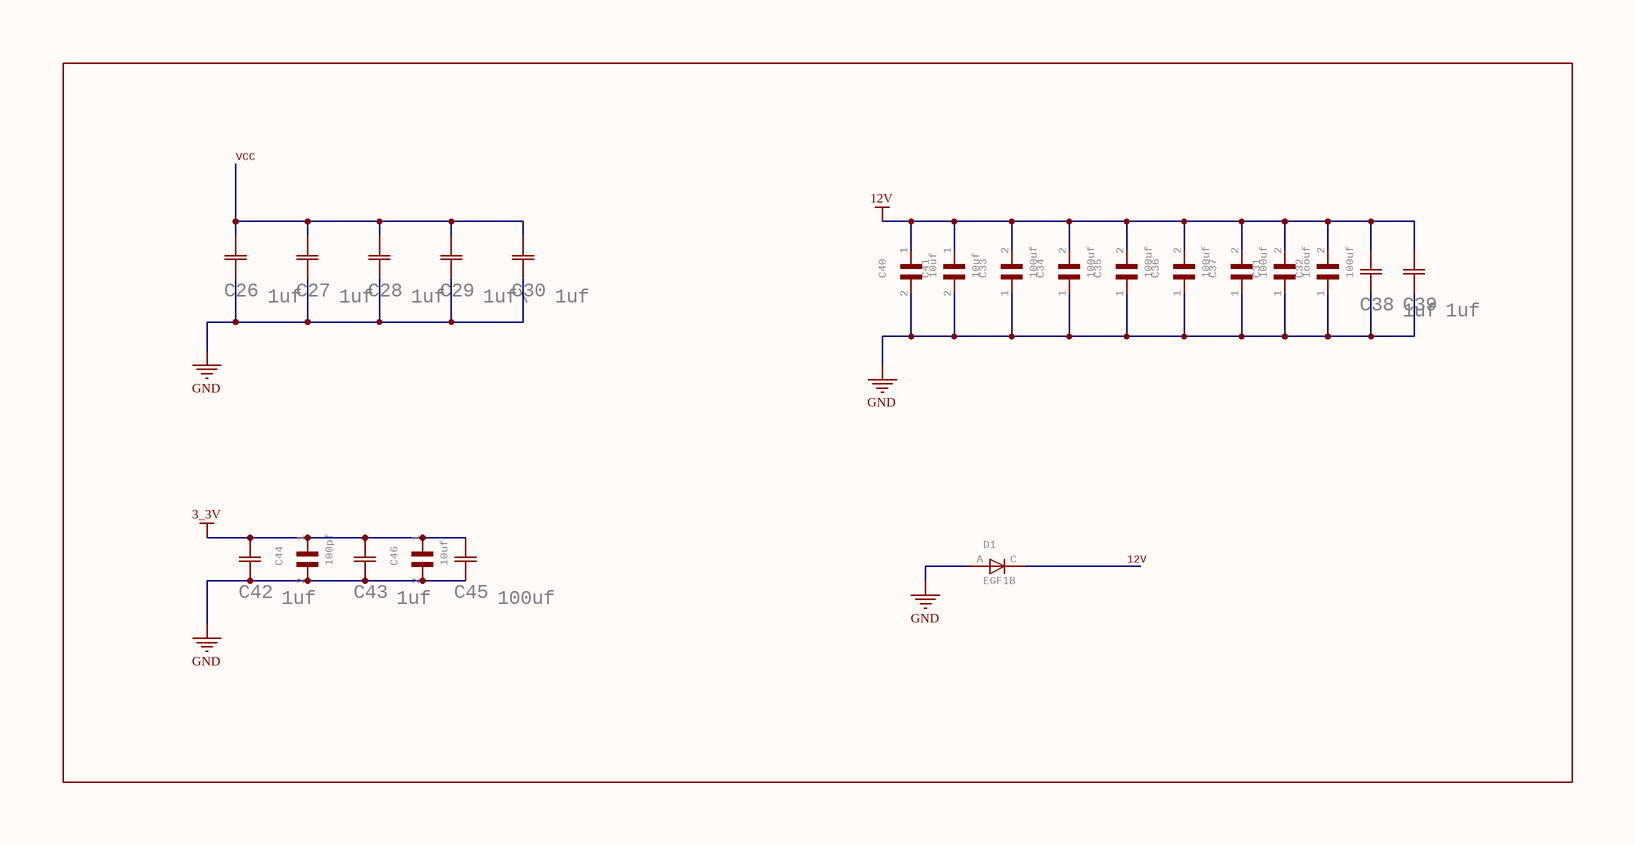
[diagram p7: Voltage_BypassCapacitors.SchDoc]

### Parts
C26  1uf  [YAG_CC0603_YAG]
C27  1uf  [YAG_CC0603_YAG]
C28  1uf  [YAG_CC0603_YAG]
C29  1uf\  [YAG_CC0603_YAG]
C30  1uf  [YAG_CC0603_YAG]
C31  1oouf  [CAPC3225X280N]
C32  100uf  [CAPC3225X280N]
C33  100uf  [CAPC3225X280N]
C34  100uf  [CAPC3225X280N]
C35  100uf  [CAPC3225X280N]
C36  100uf  [CAPC3225X280N]
C37  100uf  [CAPC3225X280N]
C38  1uf  [YAG_CC0603_YAG]
C39  1uf  [YAG_CC0603_YAG]
C40  10uf  [CAPC2012X70]
C41  10uf  [CAPC2012X70]
C42  1uf  [YAG_CC0603_YAG]
C43  1uf  [YAG_CC0603_YAG]
C44  100pf  [CAPC1608X90]
C45  100uf  [CAP_CC1210_YAG]
C46  10uf  [CAPC2012X70]
D1  EGF1B  [DIOM449X264X300L114X135N]

### Nets
3_3V: C42.2 C43.2 C44.1 C45.2 C46.1
12V: C31.2 C32.2 C33.2 C34.2 C35.2 C36.2 C37.2 C38.2 C39.2 C40.1 C41.1 D1.C
GND: C26.1 C27.1 C28.1 C29.1 C30.1 C31.1 C32.1 C33.1 C34.1 C35.1 C36.1 C37.1 C38.1 C39.1 C40.2 C41.2 C42.1 C43.1 C44.2 C45.1 C46.2 D1.A  [project net BOTTOM]
VCC: C26.2 C27.2 C28.2 C29.2 C30.2

### Library data of the parts
C26-C30 C38 C39 C42 C43 = CC0603KRX7R7BB105: as C78 on sheet EPS_Headers; LibraryName: Cap 1uf; DeviceSetName: CC0603KRX7R7BB105; MANUFACTURER_PART_NUMBER: CC0603KRX7R7BB105
C31-C37 = C1210C107M4PAC7800: GateName_1: G$1; MF: KEMET; SymbolName_1: C1210C107M4PAC7800; LibraryName: Cap 100uf 16v; DeviceSetName: C1210C107M4PAC7800; DIGI-KEY_PART_NUMBER: DIGI-KEY_PART_NUMBER; MP: C1210C107M4PAC7800; PACKAGE: 3225 KEMET
C40 C41 C46 = CC0805KKX5R7BB106: as C14 on sheet SolarPanel_PowerGeneration; SymbolName_1: CC0805KKX5R7BB106; LibraryName: Cap 10uf; DeviceSetName: CC0805KKX5R7BB106; DIGI-KEY_PART_NUMBER: 311-1865-1-ND; MP: CC0805KKX5R7BB106; PACKAGE: 0805 Yageo
C44 = CC0603KRX7R7BB101: CAP CER 100PF 16V X7R 0603; GateName_1: G$1; MF: Yageo; SymbolName_1: CC0603KRX7R7BB101; LibraryName: Cap 100p; DeviceSetName: CC0603KRX7R7BB101; DIGI-KEY_PART_NUMBER: 311-4062-1-ND; MP: CC0603KRX7R7BB101; PACKAGE: 0603 Yageo
C45 = CC1210MKX5R5BB107: as C16 on sheet SolarPanel_PowerGeneration; LibraryName: Cap 100uf 6.3v; DeviceSetName: CC1210MKX5R5BB107; COPYRIGHT: Copyright (C) 2018 Accelerated Designs. All rights reserved; DATASHEET: https://www.mouser.com/datasheet/2/447/UPY_GP_NP0_16V_to_50V_18-1730511.pdf; MANUFACTURER_PART_NUMBER: CC1210MKX5R5BB107
D1 = EGF1B: EGF1B Series 1 A 100 V 50 ns Surface Mount Fast Recovery Rectifier - DO-214AC Check prices; GateName_1: G$1; MF: ON Semiconductor; SymbolName_1: EGF1B; LibraryName: AC214 zenzer diode replace; DeviceSetName: EGF1B; AVAILABILITY: In Stock; MP: EGF1B; PACKAGE: DO-214AC-214 ON Semiconductor; PRICE: None

## Sheet PAH_Deployments.SchDoc
size 482 x 350 mm; Origin: Eagle
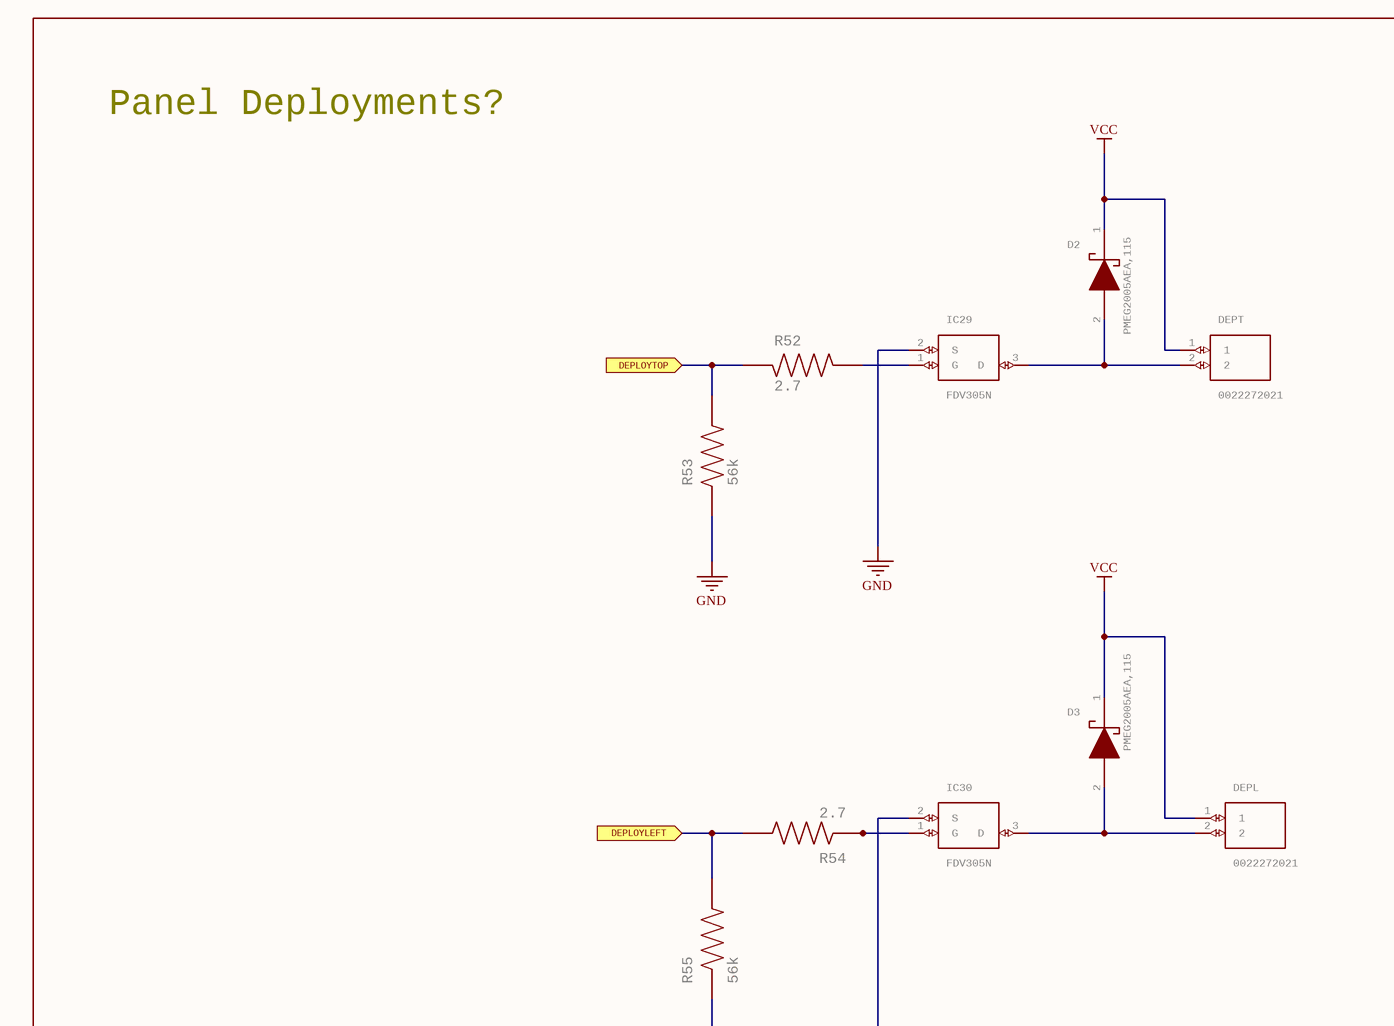
[diagram p8: PAH_Deployments.SchDoc, top left]
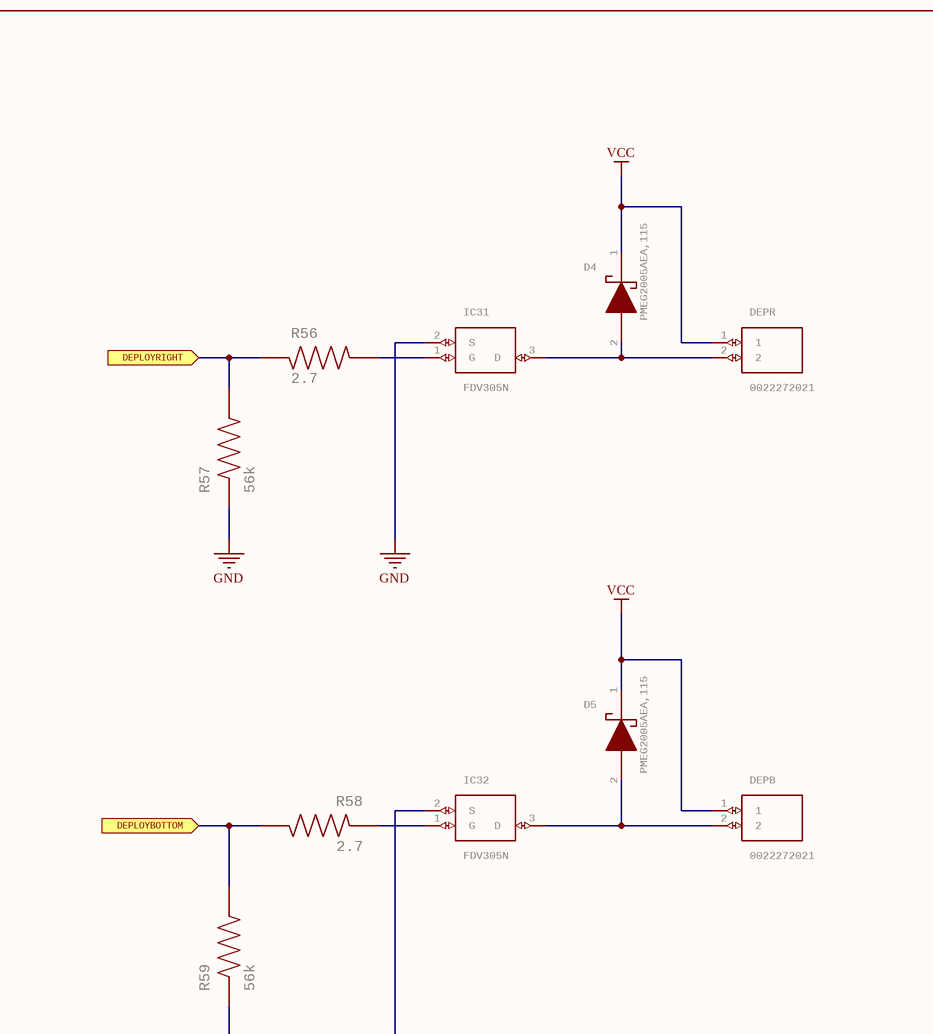
[diagram p9: PAH_Deployments.SchDoc, top right]
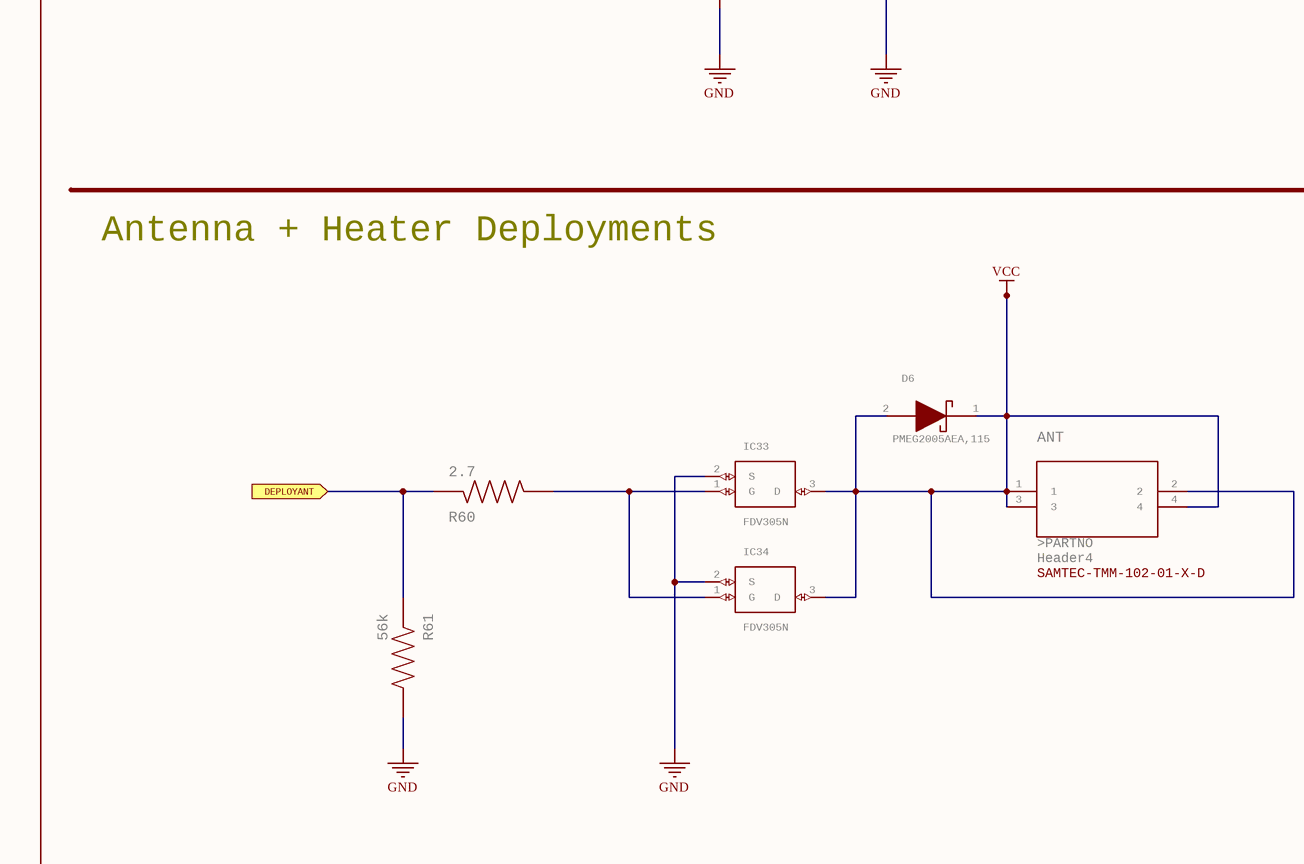
[diagram p10: PAH_Deployments.SchDoc, bottom left]
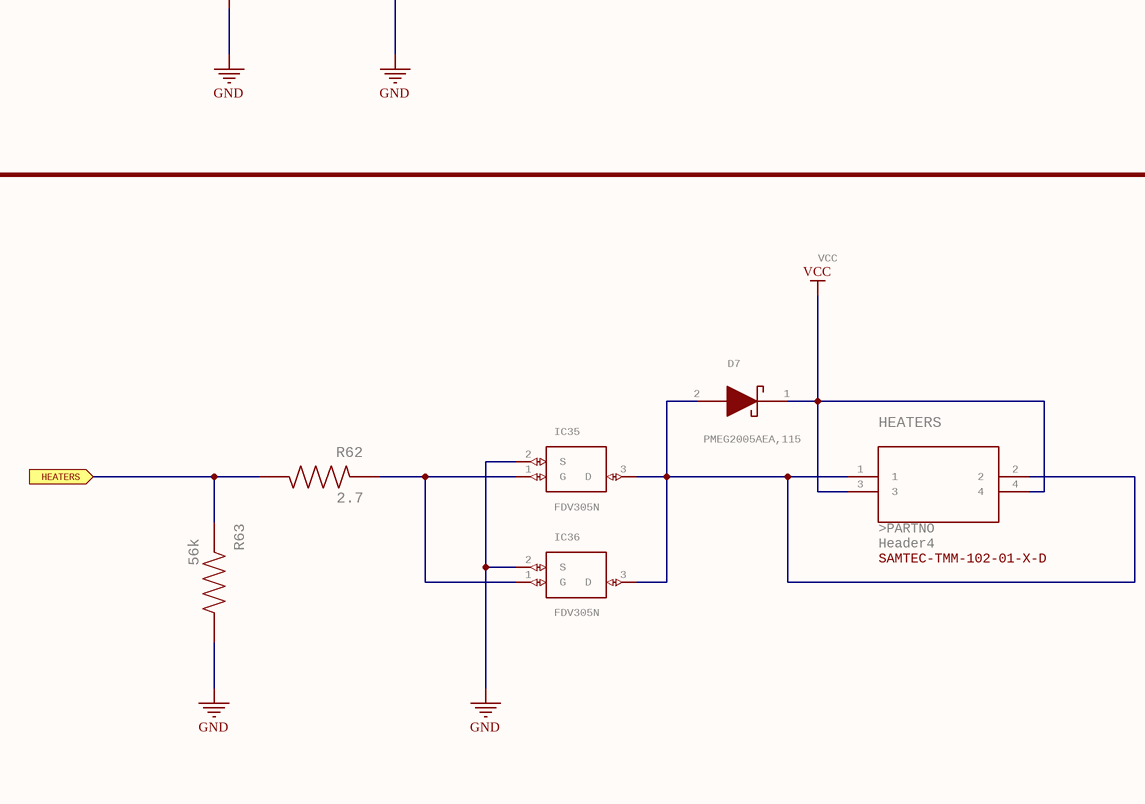
[diagram p11: PAH_Deployments.SchDoc, bottom right]

### Parts
ANT  Header4  PARTNO: >PARTNO  [SAMTEC-TMM-102-01-X-D]
D2  PMEG2005AEA,115  [SOD2512X110N]
D3  PMEG2005AEA,115  [SOD2512X110N]
D4  PMEG2005AEA,115  [SOD2512X110N]
D5  PMEG2005AEA,115  [SOD2512X110N]
D6  PMEG2005AEA,115  [SOD2512X110N]
D7  PMEG2005AEA,115  [SOD2512X110N]
DEPB  0022272021  [SHDR2W64P0X254_1X2_508X580X117]
DEPL  0022272021  [SHDR2W64P0X254_1X2_508X580X117]
DEPR  0022272021  [SHDR2W64P0X254_1X2_508X580X117]
DEPT  0022272021  [SHDR2W64P0X254_1X2_508X580X117]
HEATERS  Header4  PARTNO: >PARTNO  [SAMTEC-TMM-102-01-X-D]
IC29  FDV305N  [SOT95P240X120-3N]
IC30  FDV305N  [SOT95P240X120-3N]
IC31  FDV305N  [SOT95P240X120-3N]
IC32  FDV305N  [SOT95P240X120-3N]
IC33  FDV305N  [SOT95P240X120-3N]
IC34  FDV305N  [SOT95P240X120-3N]
IC35  FDV305N  [SOT95P240X120-3N]
IC36  FDV305N  [SOT95P240X120-3N]
R52  2.7  [RESC1608X55N]
R53  56k  [RESC1608X55N]
R54  2.7  [RESC1608X55N]
R55  56k  [RESC1608X55N]
R56  2.7  [RESC1608X55N]
R57  56k  [RESC1608X55N]
R58  2.7  [RESC1608X55N]
R59  56k  [RESC1608X55N]
R60  2.7  [RESC1608X55N]
R61  56k  [RESC1608X55N]
R62  2.7  [RESC1608X55N]
R63  56k  [RESC1608X55N]

### Ports
DEPLOYANT (in), DEPLOYBOTTOM (in), DEPLOYLEFT (in), DEPLOYRIGHT (in), DEPLOYTOP (in), HEATERS (in)

### Nets
GND: IC29.2(S) IC30.2(S) IC31.2(S) IC32.2(S) IC33.2(S) IC34.2(S) IC35.2(S) IC36.2(S) R53.1 R55.1 R57.1 R59.1 R61.2 R63.2  [project net BOTTOM]
VCC: ANT.1 ANT.2 ANT.3 ANT.4 D2.1(K) D3.1(K) D4.1(K) D5.1(K) D6.1(K) D6.2(A) D7.1(K) DEPB.1 DEPL.1 DEPR.1 DEPT.1 HEATERS.3 HEATERS.4 IC33.3(D) IC34.3(D)
DEPLOYANT: R60.1 R61.1 ; port DEPLOYANT
DEPLOYBOTTOM: R58.2 R59.2 ; port DEPLOYBOTTOM
DEPLOYLEFT: R54.2 R55.2 ; port DEPLOYLEFT
DEPLOYRIGHT: R56.2 R57.2 ; port DEPLOYRIGHT
DEPLOYTOP: R52.2 R53.2 ; port DEPLOYTOP
HEATERS: R62.2 R63.1 ; port HEATERS
NetD2_2: D2.2(A) DEPT.2 IC29.3(D)
NetD3_2: D3.2(A) DEPL.2 IC30.3(D)
NetD4_2: D4.2(A) DEPR.2 IC31.3(D)
NetD5_2: D5.2(A) DEPB.2 IC32.3(D)
NetD7_2: D7.2(A) HEATERS.1 HEATERS.2 IC35.3(D) IC36.3(D)
NetIC29_1: IC29.1(G) R52.1
NetIC30_1: IC30.1(G) R54.1
NetIC31_1: IC31.1(G) R56.1
NetIC32_1: IC32.1(G) R58.1
NetIC33_1: IC33.1(G) IC34.1(G) R60.2
NetIC35_1: IC35.1(G) IC36.1(G) R62.1

### Notes on the sheet
- Panel Deployments?
- Antenna + Heater Deployments
- VCC

### Library data of the parts
ANT HEATERS = SAMTEC-TMM-102-01-X-DJ: as UMB on sheet EPS_Headers; LibraryName: 4 pin header replace; DeviceSetName: SAMTEC-TMM-102-01-X-D; SAMTEC-TMM-102-01-X-D: SAMTEC-TMM-102-01-X-D; AVAILABILITY: In Stock; PACKAGE: None; PRICE: None; PURCHASE-URL: https://pricing.snapeda.com/search/part/TMM-102-01-T-D/?ref=eda
D2-D7 = PMEG2005AEA,115: NXP PMEG2005AEA,115, SMT Schottky Diode, 20V 500mA, 2-Pin SOD-323   Source:  Datasheet; MANUFACTURER_NAME: Nexperia; GateName_1: G$1; SymbolName_1: PMEG2005AEA,115; LibraryName: PMEG2005AEA_115; DeviceSetName: PMEG2005AEA,115; ARROW_PART_NUMBER: PMEG2005AEA,115; ARROW_PRICE-STOCK: https://www.arrow.com/en/products/pmeg2005aea115/nexperia; HEIGHT: 1.1mm; MANUFACTURER_PART_NUMBER: PMEG2005AEA,115; MOUSER_PART_NUMBER: 771-PMEG2005AEA115; MOUSER_PRICE-STOCK: https://www.mouser.co.uk/ProductDetail/Nexperia/PMEG2005AEA115?qs=LOCUfHb8d9v8DU9iEgA%252BhA%3D%3D
DEPB DEPL DEPR DEPT = 0022272021: as BAT on sheet EPS_Headers; SymbolName_1: 0022272021; LibraryName: header 2; DeviceSetName: 0022272021; ARROW_PART_NUMBER: 0022272021; ARROW_PRICE-STOCK: https://www.arrow.com/en/products/0022272021/molex; HEIGHT: 11.7mm; MANUFACTURER_PART_NUMBER: 0022272021; MOUSER_PART_NUMBER: N/A; MOUSER_PRICE-STOCK: https://www.mouser.co.uk/ProductDetail/Molex/0022272021?qs=PBcRNPEHKsoTuJ7eDXMaUA%3D%3D
IC29-IC36 = FDV305N: FDV305N, N-channel MOSFET Transistor 0.9 A 20 V, 3-Pin SOT-23   Source:  Datasheet; MANUFACTURER_NAME: ON Semiconductor; GateName_1: G$1; SymbolName_1: FDV305N; LibraryName: FDV305N; DeviceSetName: FDV305N; ARROW_PART_NUMBER: FDV305N; ARROW_PRICE-STOCK: https://www.arrow.com/en/products/fdv305n/on-semiconductor; HEIGHT: 1.2mm; MANUFACTURER_PART_NUMBER: FDV305N; MOUSER_PART_NUMBER: 512-FDV305N; MOUSER_PRICE-STOCK: https://www.mouser.co.uk/ProductDetail/ON-Semiconductor-Fairchild/FDV305N?qs=mdiO5HdF0KjwjAZb7xdQ1g%3D%3D
R52 R54 R56 R58 R60 R62 = RL0816S-2R7-F: GateName_1: G$1; MF: Susumu; SymbolName_1: RL0816S-2R7-F; LibraryName: Res1-2.7; DeviceSetName: RL0816S-2R7-F; DIGI-KEY_PART_NUMBER: DIGI-KEY_PART_NUMBER; MP: RL0816S-2R7-F; PACKAGE: 1608 Susumu
R53 R55 R57 R59 R61 R63 = ERJ-PB3D5602V: as R2 on sheet EPS_Headers; SymbolName_1: ERJ-PB3D5602V; LibraryName: Res1 56k; DeviceSetName: ERJ-PB3D5602V; DIGI-KEY_PART_NUMBER: DIGI-KEY_PART_NUMBER; MP: ERJ-PB3D5602V; PACKAGE: 1608 Panasonic Electronic Components

## Sheet System_VoltageControl.SchDoc
size 541 x 447 mm; Origin: Eagle
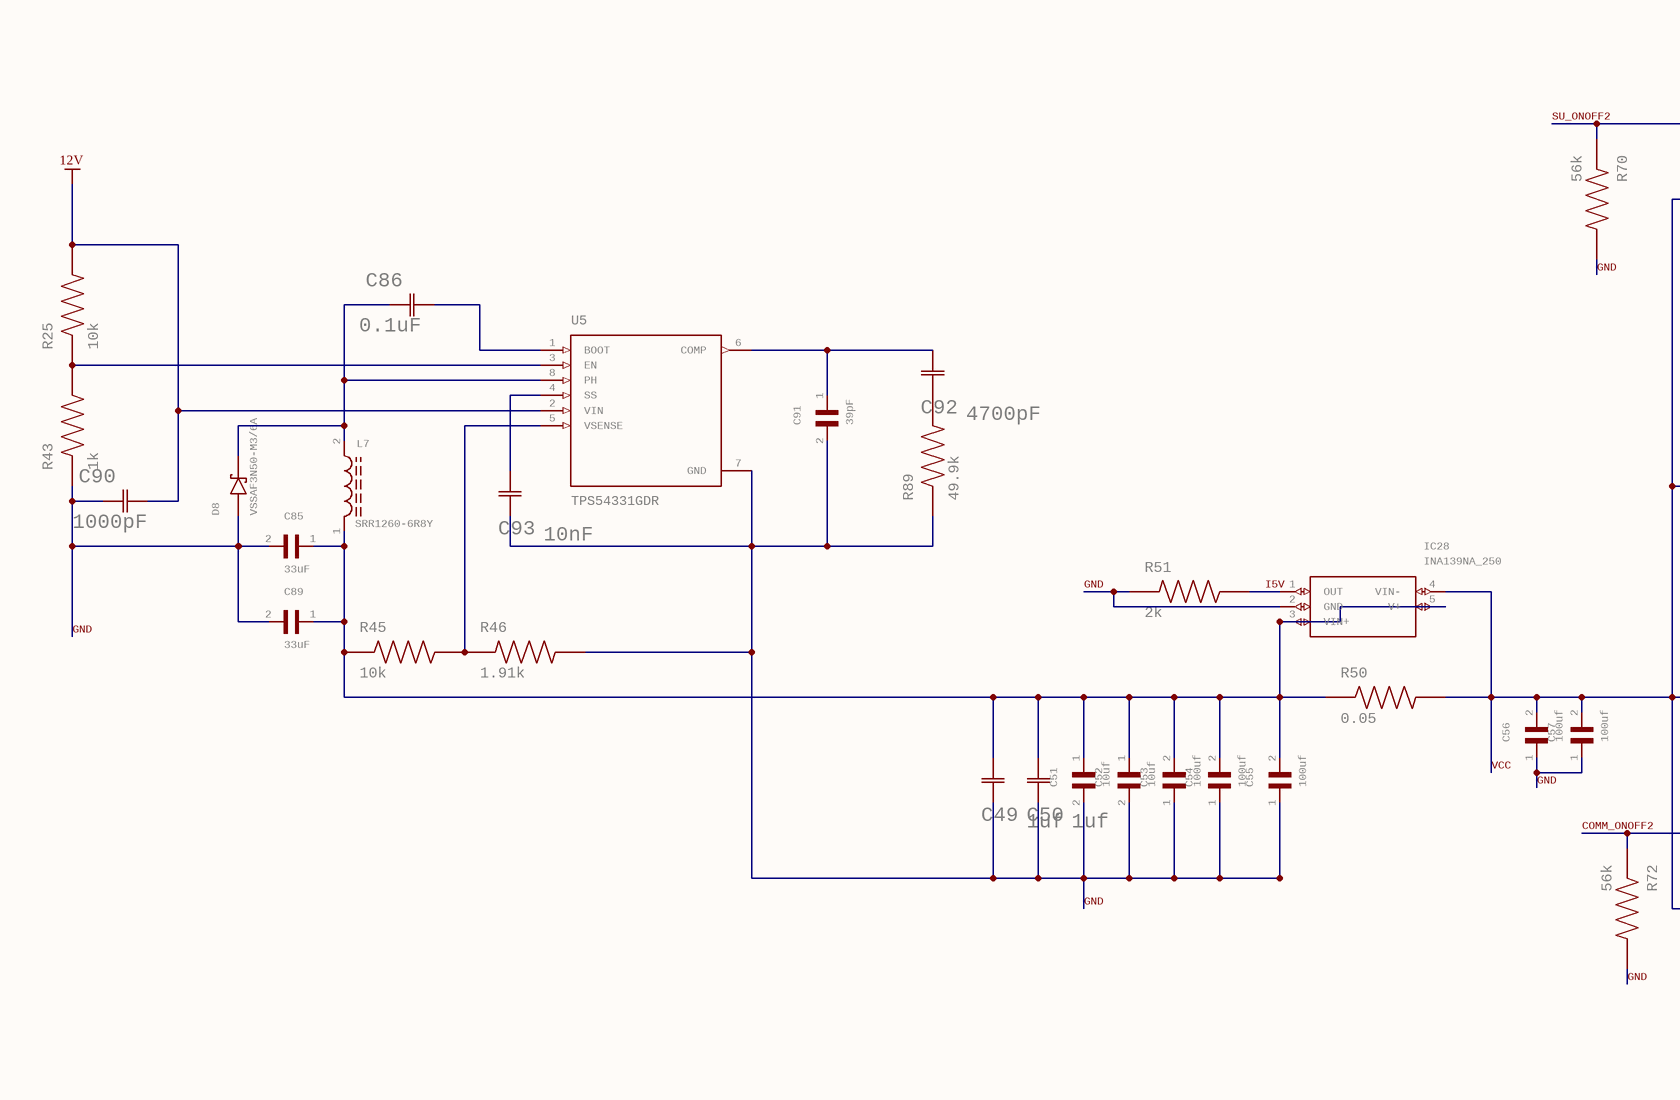
[diagram p12: System_VoltageControl.SchDoc, top left]
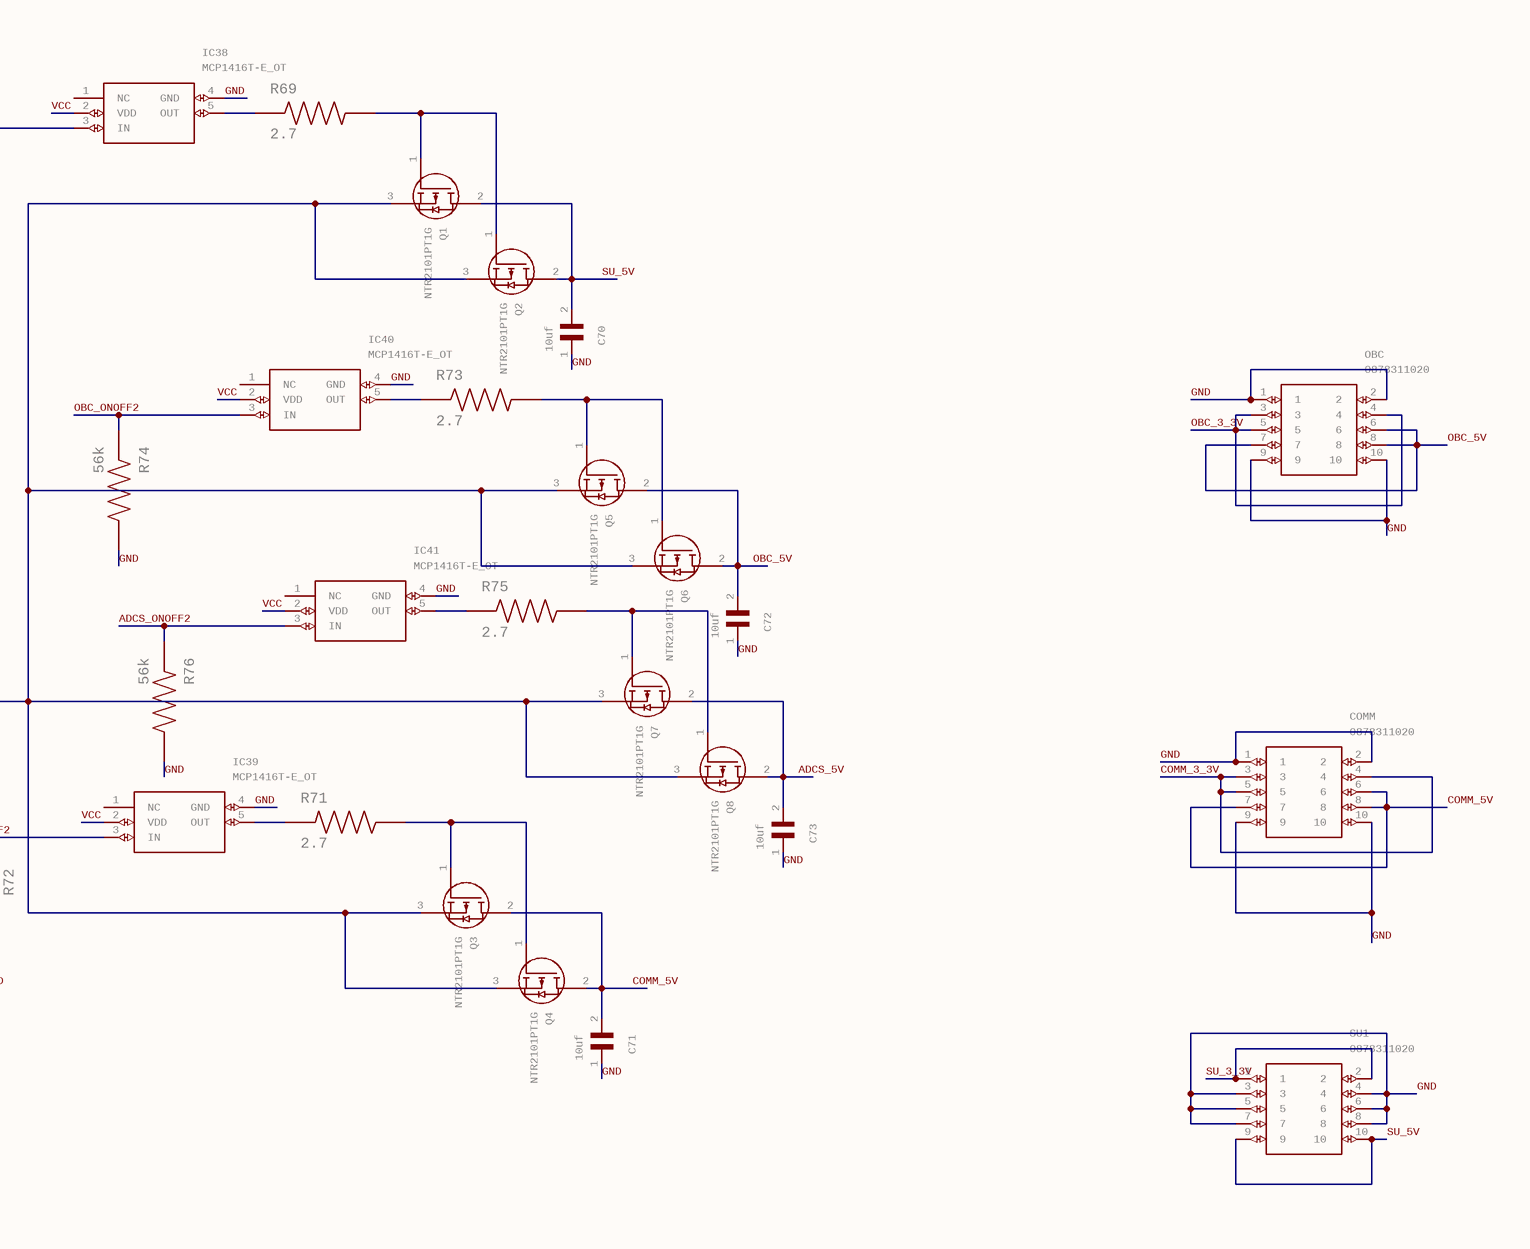
[diagram p13: System_VoltageControl.SchDoc, top right]
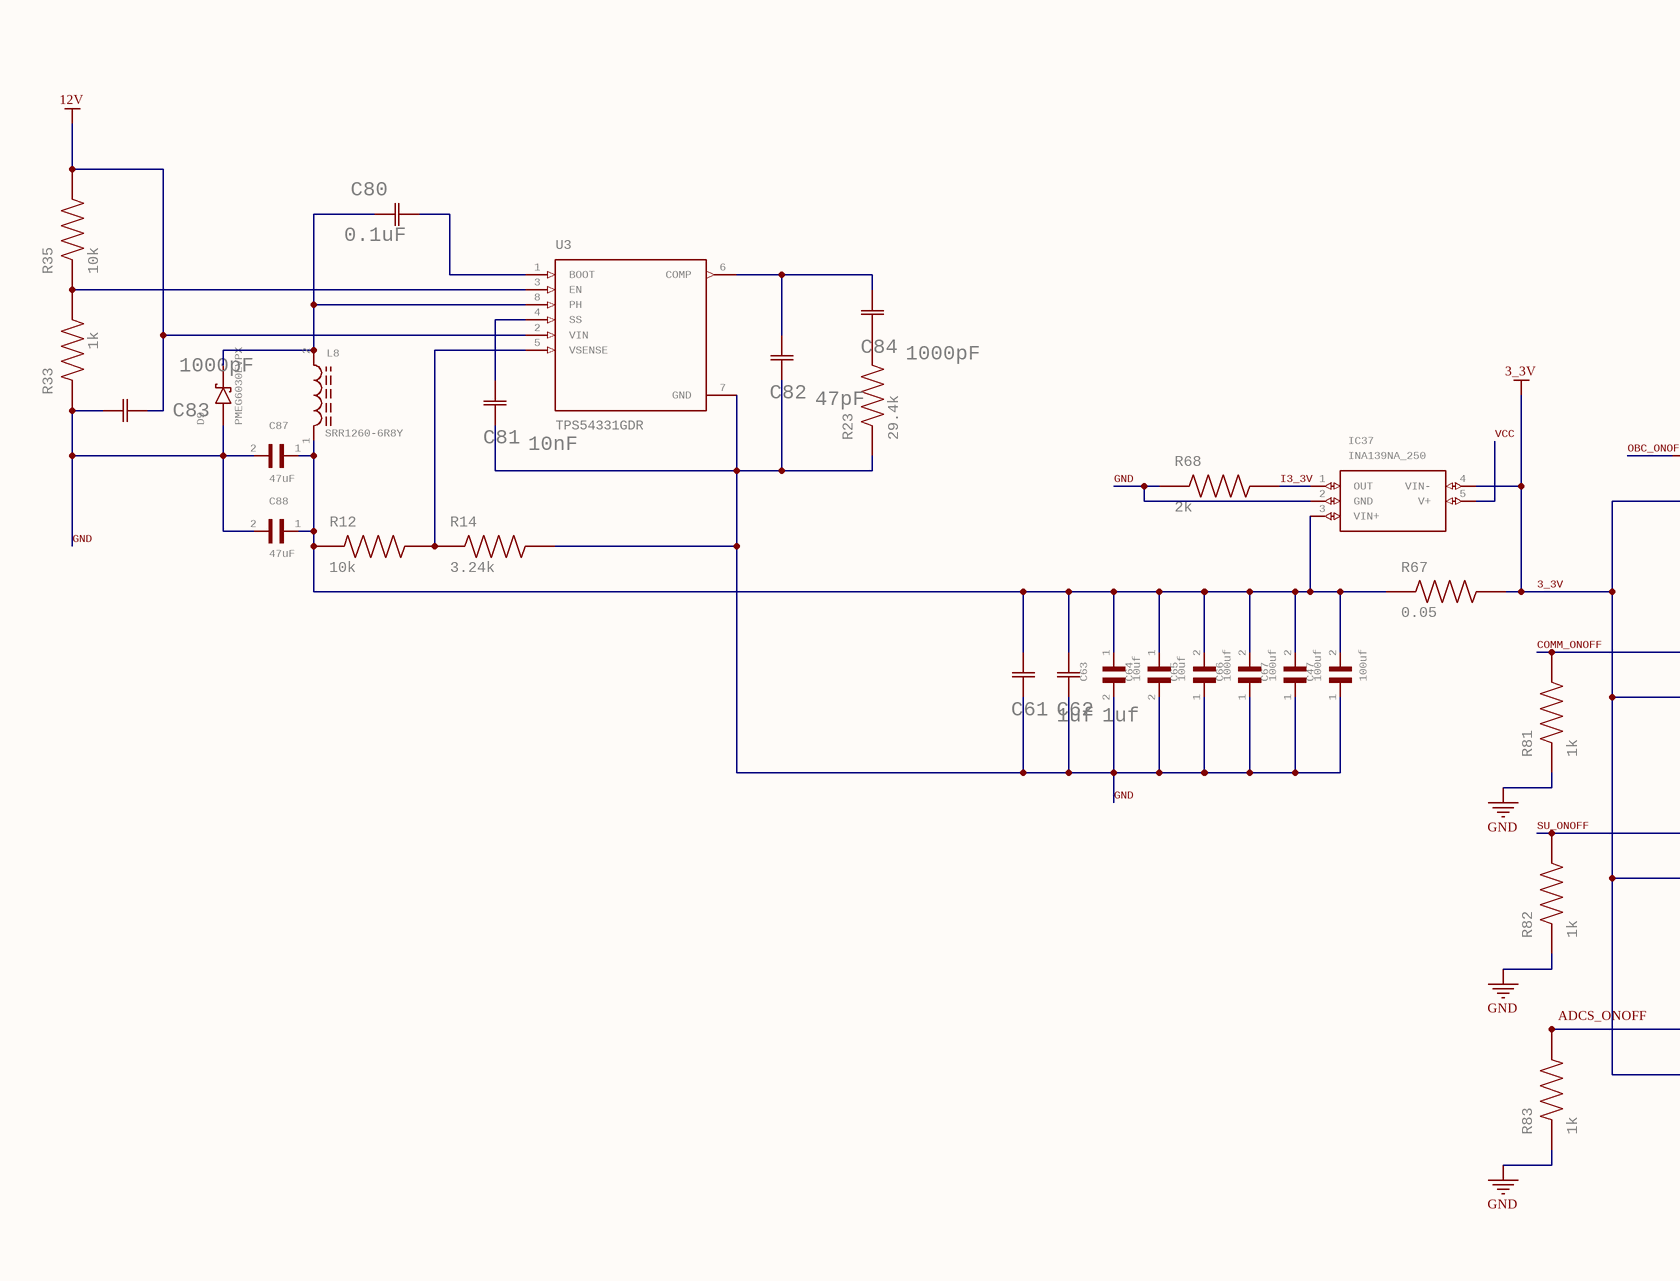
[diagram p14: System_VoltageControl.SchDoc, bottom left]
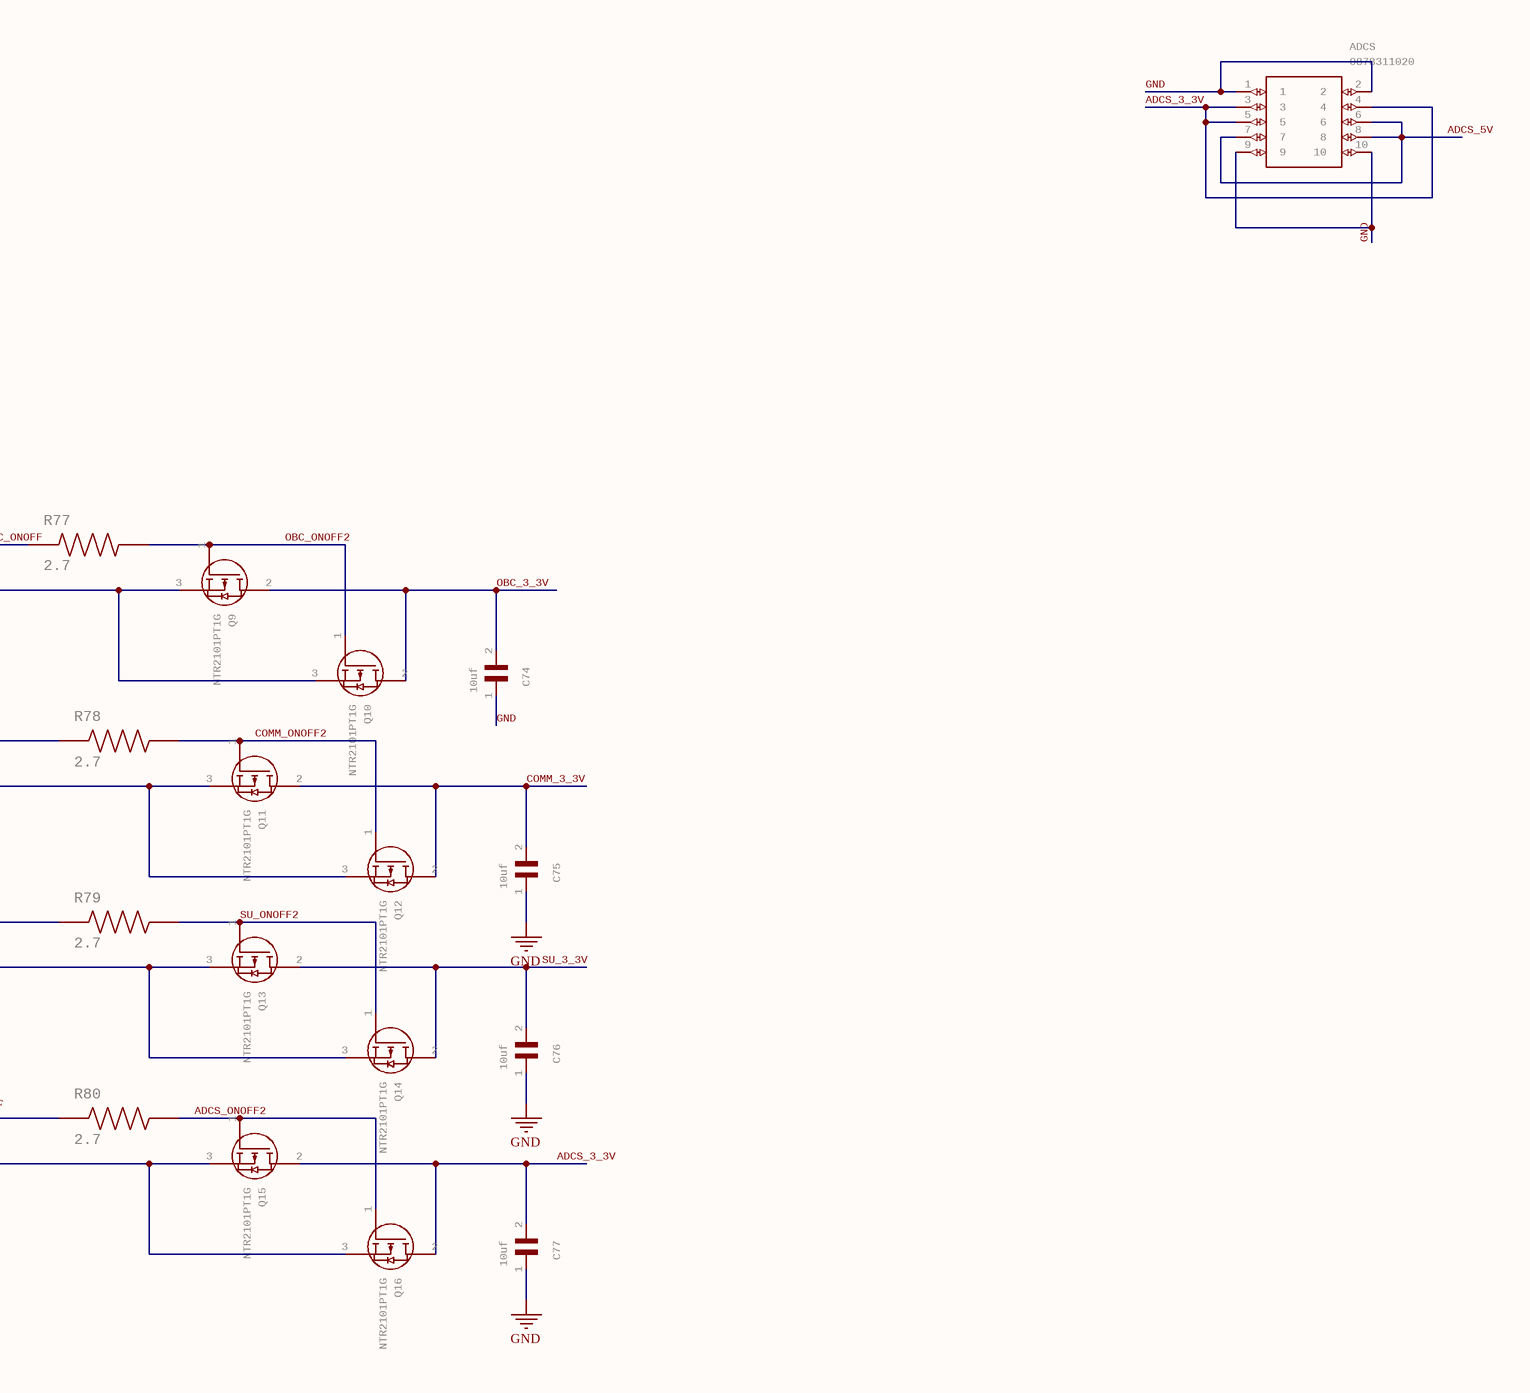
[diagram p15: System_VoltageControl.SchDoc, bottom right]

### Parts
ADCS  0878311020  [SHDR10W55P200_2X5_1265X630X640]
C47  100uf  [CAPC3225X280N]
C49  1uf  [YAG_CC0603_YAG]
C50  1uf  [YAG_CC0603_YAG]
C51  10uf  [CAPC2012X70]
C52  10uf  [CAPC2012X70]
C53  100uf  [CAPC3225X280N]
C54  100uf  [CAPC3225X280N]
C55  100uf  [CAPC3225X280N]
C56  100uf  [CAPC3225X280N]
C57  100uf  [CAPC3225X280N]
C61  1uf  [YAG_CC0603_YAG]
C62  1uf  [YAG_CC0603_YAG]
C63  10uf  [CAPC2012X70]
C64  10uf  [CAPC2012X70]
C65  100uf  [CAPC3225X280N]
C66  100uf  [CAPC3225X280N]
C67  100uf  [CAPC3225X280N]
C70  10uf  [CAPC2012X70]
C71  10uf  [CAPC2012X70]
C72  10uf  [CAPC2012X70]
C73  10uf  [CAPC2012X70]
C74  10uf  [CAPC2012X70]
C75  10uf  [CAPC2012X70]
C76  10uf  [CAPC2012X70]
C77  10uf  [CAPC2012X70]
C80  0.1uF  [CC0603N_YAG]
C81  10nF  [CC0603N_YAG]
C82  47pF  [CC0603N_YAG]
C83  1000pF  [CC0603N_YAG]
C84  1000pF  [CC0603N_YAG]
C85  33uF  [CAPC2012X70]
C86  0.1uF  [CC0603N_YAG]
C87  47uF  [CAPC2012X70]
C88  47uF  [CAPC2012X70]
C89  33uF  [CAPC2012X70]
C90  1000pF  [CC0603N_YAG]
C91  39pF  [CAPC2012X70]
C92  4700pF  [CC0603N_YAG]
C93  10nF  [CC0603N_YAG]
COMM  0878311020  [SHDR10W55P200_2X5_1265X630X640]
D8  VSSAF3N50-M3/6A  [DIOM5226X100N]
D9  PMEG6030EVPX  [DIO_PMEG6030EVPX]
IC28  INA139NA_250  [SOT95P280X145-5N]
IC37  INA139NA_250  [SOT95P280X145-5N]
IC38  MCP1416T-E_OT  [SOT95P270X145-5N]
IC39  MCP1416T-E_OT  [SOT95P270X145-5N]
IC40  MCP1416T-E_OT  [SOT95P270X145-5N]
IC41  MCP1416T-E_OT  [SOT95P270X145-5N]
L7  SRR1260-6R8Y  [INDP125125X600N]
L8  SRR1260-6R8Y  [INDP125125X600N]
OBC  0878311020  [SHDR10W55P200_2X5_1265X630X640]
Q1  NTR2101PT1G  [SOT96P237X111-3N]
Q2  NTR2101PT1G  [SOT96P237X111-3N]
Q3  NTR2101PT1G  [SOT96P237X111-3N]
Q4  NTR2101PT1G  [SOT96P237X111-3N]
Q5  NTR2101PT1G  [SOT96P237X111-3N]
Q6  NTR2101PT1G  [SOT96P237X111-3N]
Q7  NTR2101PT1G  [SOT96P237X111-3N]
Q8  NTR2101PT1G  [SOT96P237X111-3N]
Q9  NTR2101PT1G  [SOT96P237X111-3N]
Q10  NTR2101PT1G  [SOT96P237X111-3N]
Q11  NTR2101PT1G  [SOT96P237X111-3N]
Q12  NTR2101PT1G  [SOT96P237X111-3N]
Q13  NTR2101PT1G  [SOT96P237X111-3N]
Q14  NTR2101PT1G  [SOT96P237X111-3N]
Q15  NTR2101PT1G  [SOT96P237X111-3N]
Q16  NTR2101PT1G  [SOT96P237X111-3N]
R12  10k  [RESC1608X55N]
R14  3.24k  [RESC1608X55N]
R23  29.4k  [RESC1608X55N]
R25  10k  [RESC1608X55N]
R33  1k  [RESC1608X55N]
R35  10k  [RESC1608X55N]
R43  1k  [RESC1608X55N]
R45  10k  [RESC1608X55N]
R46  1.91k  [RESC1608X55N]
R50  0.05  [RESC1608X55N]
R51  2k  [RESC1608X55N]
R67  0.05  [RESC1608X55N]
R68  2k  [RESC1608X55N]
R69  2.7  [RESC1608X55N]
R70  56k  [RESC1608X55N]
R71  2.7  [RESC1608X55N]
R72  56k  [RESC1608X55N]
R73  2.7  [RESC1608X55N]
R74  56k  [RESC1608X55N]
R75  2.7  [RESC1608X55N]
R76  56k  [RESC1608X55N]
R77  2.7  [RESC1608X55N]
R78  2.7  [RESC1608X55N]
R79  2.7  [RESC1608X55N]
R80  2.7  [RESC1608X55N]
R81  1k  [RESC1608X55N]
R82  1k  [RESC1608X55N]
R83  1k  [RESC1608X55N]
R89  49.9k  [RESC1608X55N]
SU1  0878311020  [SHDR10W55P200_2X5_1265X630X640]
U3  TPS54331GDR  [SOIC127P599X175-8N]
U5  TPS54331GDR  [SOIC127P599X175-8N]

### Nets
3_3V: IC37.4(VIN-) Q9.3(D) Q10.3(D) Q11.3(D) Q12.3(D) Q13.3(D) Q14.3(D) Q15.3(D) Q16.3(D) R67.2
12V: C83.1 C90.2 R25.2 R35.2 U3.2(VIN) U5.2(VIN)
GND: ADCS.1 ADCS.2 ADCS.9 ADCS.10 C47.1 C49.1 C50.1 C51.2 C52.2 C53.1 C54.1 C55.1 C56.1 C57.1 C61.1 C62.1 C63.2 C64.2 C65.1 C66.1 C67.1 C70.1 C71.1 C72.1 C73.1 C74.1 C75.1 C76.1 C77.1 C81.1 C82.1 C83.2 C85.2 C87.2 C88.2 C89.2 C90.1 C91.2 C93.1 COMM.1 COMM.2 COMM.9 COMM.10 D8.A D9.2(A) IC28.2(GND) IC37.2(GND) IC38.4(GND) IC39.4(GND) IC40.4(GND) IC41.4(GND) OBC.1 OBC.2 OBC.9 OBC.10 R14.2 R23.1 R33.1 R43.1 R46.2 R51.1 R68.1 R70.2 R72.2 R74.2 R76.2 R81.1 R82.1 R83.1 R89.1 SU1.3 SU1.4 SU1.5 SU1.6 SU1.7 SU1.8 U3.7(GND) U5.7(GND)  [project net BOTTOM]
ADCS_3_3V: ADCS.3 ADCS.4 ADCS.5 C77.2 Q15.2(S) Q16.2(S)
ADCS_5V: ADCS.6 ADCS.7 ADCS.8 C73.2 Q7.2(S) Q8.2(S)
ADCS_ONOFF2: IC41.3(IN) Q15.1(G) Q16.1(G) R76.1 R80.2
COMM_3_3V: C75.2 COMM.3 COMM.4 COMM.5 Q11.2(S) Q12.2(S)
COMM_5V: C71.2 COMM.6 COMM.7 COMM.8 Q3.2(S) Q4.2(S)
COMM_ONOFF: R78.1 R81.2
COMM_ONOFF2: IC39.3(IN) Q11.1(G) Q12.1(G) R72.1 R78.2
I3_3V: IC37.1(OUT) R68.2
I5V: IC28.1(OUT) R51.2
OBC_3_3V: C74.2 OBC.3 OBC.4 OBC.5 Q9.2(S) Q10.2(S)
OBC_5V: C72.2 OBC.6 OBC.7 OBC.8 Q5.2(S) Q6.2(S)
OBC_ONOFF: R77.1
OBC_ONOFF2: IC40.3(IN) Q9.1(G) Q10.1(G) R74.1 R77.2
SU_3_3V: C76.2 Q13.2(S) Q14.2(S) SU1.1 SU1.2
SU_5V: C70.2 Q1.2(S) Q2.2(S) SU1.9 SU1.10
SU_ONOFF: R79.1 R82.2
SU_ONOFF2: IC38.3(IN) Q13.1(G) Q14.1(G) R70.1 R79.2
VCC: C56.2 C57.2 IC28.4(VIN-) IC37.5(V+) IC38.2(VDD) IC39.2(VDD) IC40.2(VDD) IC41.2(VDD) Q1.3(D) Q2.3(D) Q3.3(D) Q4.3(D) Q5.3(D) Q6.3(D) Q7.3(D) Q8.3(D) R50.2
NetC47_2: C47.2 C61.2 C62.2 C63.1 C64.1 C65.2 C66.2 C67.2 C87.1 C88.1 IC37.3(VIN+) L8.1 R12.1 R67.1
NetC49_2: C49.2 C50.2 C51.1 C52.1 C53.2 C54.2 C55.2 C85.1 C89.1 IC28.3(VIN+) IC28.5(V+) L7.1 R45.1 R50.1
NetC80_1: C80.1 D9.1(K) L8.2 U3.8(PH)
NetC80_2: C80.2 U3.1(BOOT)
NetC81_2: C81.2 U3.4(SS)
NetC82_2: C82.2 C84.2 U3.6(COMP)
NetC84_1: C84.1 R23.2
NetC86_1: C86.1 D8.C(K) L7.2 U5.8(PH)
NetC86_2: C86.2 U5.1(BOOT)
NetC91_1: C91.1 C92.2 U5.6(COMP)
NetC92_1: C92.1 R89.2
NetC93_2: C93.2 U5.4(SS)
NetIC38_5: IC38.5(OUT) R69.1
NetIC39_5: IC39.5(OUT) R71.1
NetIC40_5: IC40.5(OUT) R73.1
NetIC41_5: IC41.5(OUT) R75.1
NetQ1_1: Q1.1(G) Q2.1(G) R69.2
NetQ3_1: Q3.1(G) Q4.1(G) R71.2
NetQ5_1: Q5.1(G) Q6.1(G) R73.2
NetQ7_1: Q7.1(G) Q8.1(G) R75.2
NetR12_2: R12.2 R14.1 U3.5(VSENSE)
NetR25_1: R25.1 R43.2 U5.3(EN)
NetR33_2: R33.2 R35.1 U3.3(EN)
NetR45_2: R45.2 R46.1 U5.5(VSENSE)
NetR80_1: R80.1 R83.2

Not connected (* = marked no-connect by the designer): IC38 1(NC); IC39 1(NC); IC40 1(NC); IC41 1(NC)

### Notes on the sheet
- Labels drawn without touching a wire or pin: ADCS_ONOFF

### Library data of the parts
ADCS COMM OBC SU1 = 0878311020: Headers & Wire Housings 2.00MM HDR 02X05P VT TH 15AU   Source:  Datasheet; MANUFACTURER_NAME: Molex; GateName_1: G$1; SymbolName_1: 0878311020; LibraryName: 0878311020; DeviceSetName: 0878311020; ARROW_PART_NUMBER: 0878311020; ARROW_PRICE-STOCK: https://www.arrow.com/en/products/0878311020/molex; HEIGHT: 6.4mm; MANUFACTURER_PART_NUMBER: 0878311020; MOUSER_PART_NUMBER: N/A; MOUSER_PRICE-STOCK: https://www.mouser.co.uk/ProductDetail/Molex/0878311020?qs=PBcRNPEHKsp4n%252By2XJ%252BEjQ%3D%3D
C47 C53-C57 C65-C67 = C1210C107M4PAC7800: GateName_1: G$1; MF: KEMET; SymbolName_1: C1210C107M4PAC7800; LibraryName: Cap 100uf 16v; DeviceSetName: C1210C107M4PAC7800; DIGI-KEY_PART_NUMBER: DIGI-KEY_PART_NUMBER; MP: C1210C107M4PAC7800; PACKAGE: 3225 KEMET
C49 C50 C61 C62 = CC0603KRX7R7BB105: as C78 on sheet EPS_Headers; LibraryName: Cap 1uf; DeviceSetName: CC0603KRX7R7BB105; MANUFACTURER_PART_NUMBER: CC0603KRX7R7BB105
C51 C52 C63 C64 C70-C77 C85 C87-C89 C91 = CC0805KKX5R7BB106: as C14 on sheet SolarPanel_PowerGeneration; SymbolName_1: CC0805KKX5R7BB106; LibraryName: Cap 10uf; DeviceSetName: CC0805KKX5R7BB106; DIGI-KEY_PART_NUMBER: 311-1865-1-ND; MP: CC0805KKX5R7BB106; PACKAGE: 0805 Yageo
C80-C84 C86 C90 C92 C93 = CC0603KRX7R7BB104: GateName_1: A; SymbolName_1: CAPH; BUILT_BY: EMA_UL_Team; SOURCELIBRARY: Yageo_2008-01-01_ChipCaps1; VENDOR: Yageo; LibraryName: Cap 0.1uf; DeviceSetName: CC0603KRX7R7BB104; MANUFACTURER_PART_NUMBER: CC0603KRX7R7BB104
D8 = VSSAF3N50-M3/6A: Diode Schottky 50V 3A 2-Pin DO-221AC Plastic T/R Check prices; GateName_1: G$1; MF: Vishay Semiconductor; SymbolName_1: VSSAF3N50-M3/6A; LibraryName: VSSAF3N50-M3_6A; DeviceSetName: VSSAF3N50-M3/6A; AVAILABILITY: In Stock; MP: VSSAF3N50-M3/6A; PACKAGE: DO-221AC-221 Vishay Semiconductor Diodes Division; PRICE: None; PURCHASE-URL: https://pricing.snapeda.com/search/part/VSSAF3N50-M3/6A/?ref=eda
D9 = PMEG6030EVPX: PMEG6030 Series 60 V 3 A Surface Mount Schottky Barrier Rectifier - SOD-128 Check prices; GateName_1: G$1; MF: Nexperia USA; SymbolName_1: PMEG6030EVPX; LibraryName: PMEG6030EVPX; DeviceSetName: PMEG6030EVPX; AVAILABILITY: In Stock; MP: PMEG6030EVPX; PACKAGE: CFP5-2 Nexperia USA Inc.; PRICE: None; PURCHASE-URL: https://pricing.snapeda.com/search/part/PMEG6030EVPX/?ref=eda
IC28 IC37 = INA139NA_250: as IC3 on sheet EPS_Headers; SymbolName_1: INA139NA_250; LibraryName: INA139NA_250; DeviceSetName: INA139NA_250; ARROW_PART_NUMBER: INA139NA/250; ARROW_PRICE-STOCK: https://www.arrow.com/en/products/ina139na250/texas-instruments; HEIGHT: 1.45mm; MOUSER_PART_NUMBER: 595-INA139NA/250; MOUSER_PRICE-STOCK: https://www.mouser.co.uk/ProductDetail/Texas-Instruments/INA139NA-250?qs=VBduBm9rCJQSYOixXF05Zw%3D%3D
IC38-IC41 = MCP1416T-E_OT: as IC8 on sheet SolarPanel_PowerGeneration; SymbolName_1: MCP1416T-E_OT; LibraryName: MCP1416T-E_OT; DeviceSetName: MCP1416T-E_OT; ARROW_PART_NUMBER: MCP1416T-E/OT; ARROW_PRICE-STOCK: https://www.arrow.com/en/products/mcp1416t-eot/microchip-technology; HEIGHT: 1.45mm; MOUSER_PART_NUMBER: 579-MCP1416T-E/OT; MOUSER_PRICE-STOCK: https://www.mouser.co.uk/ProductDetail/Microchip-Technology/MCP1416T-E-OT?qs=hH%252BOa0VZEiBT%252BgAjATFU6A%3D%3D
L7 L8 = SRR1260-150M: Inductor Power Shielded Wirewound 33uH 20% 100KHz 27Q-Factor Ferrite 3A 60mOhm DCR T/R Check prices; GateName_1: G$1; MF: Bourns; SymbolName_1: SRR1260-150M; LibraryName: SRR1260-150M; DeviceSetName: SRR1260-150M; AVAILABILITY: In Stock; MP: SRR1260-150M; PACKAGE: Nonstandard Bourns; PRICE: None; PURCHASE-URL: https://pricing.snapeda.com/search/part/SRR1260-150M/?ref=eda
Q1-Q16 = NTR2101PT1G: as Q17 on sheet EPS_Headers; SymbolName_1: NTR2101PT1G; LibraryName: MOSFET-P; DeviceSetName: NTR2101PT1G; ARROW_PART_NUMBER: NTR2101PT1G; ARROW_PRICE-STOCK: https://www.arrow.com/en/products/ntr2101pt1g/on-semiconductor; HEIGHT: 1.11mm; MANUFACTURER_PART_NUMBER: NTR2101PT1G; MOUSER_PART_NUMBER: 863-NTR2101PT1G; MOUSER_PRICE-STOCK: https://www.mouser.co.uk/ProductDetail/ON-Semiconductor/NTR2101PT1G?qs=ZXBb0xZ9WeAElbwG%2FHcx4g%3D%3D
R12 R14 R23 R25 R33 R35 R43 R45 R46 R69 R71 R73 R75 R77-R80 R89 = RL0816S-2R7-F: GateName_1: G$1; MF: Susumu; SymbolName_1: RL0816S-2R7-F; LibraryName: Res1-2.7; DeviceSetName: RL0816S-2R7-F; DIGI-KEY_PART_NUMBER: DIGI-KEY_PART_NUMBER; MP: RL0816S-2R7-F; PACKAGE: 1608 Susumu
R50 R67 = ERJ-L03KJ50MV: as R9 on sheet SolarPanel_PowerGeneration; SymbolName_1: ERJ-L03KJ50MV; LibraryName: Res1 0.05; DeviceSetName: ERJ-L03KJ50MV; DIGI-KEY_PART_NUMBER: P50NJCT-ND; MP: ERJ-L03KJ50MV; PACKAGE: 1608-2 Panasonic
R51 R68 = ERJ-PB3D2001V: Res Thick Film 0603 2K Ohm 5% 0.2W(1/5W) Â±50ppm/C Pad SMD Automotive T/R; GateName_1: G$1; MF: Panasonic; SymbolName_1: ERJ-PB3D2001V; LibraryName: Res1 2k; DeviceSetName: ERJ-PB3D2001V; DIGI-KEY_PART_NUMBER: P20315CT-ND; MP: ERJ-PB3D2001V; PACKAGE: 1608 Panasonic Electronic Components
R70 R72 R74 R76 = ERJ-PB3D5602V: as R2 on sheet EPS_Headers; SymbolName_1: ERJ-PB3D5602V; LibraryName: Res1 56k; DeviceSetName: ERJ-PB3D5602V; DIGI-KEY_PART_NUMBER: DIGI-KEY_PART_NUMBER; MP: ERJ-PB3D5602V; PACKAGE: 1608 Panasonic Electronic Components
R81-R83 = ERJ-PB3D1001V: as R1 on sheet EPS_Headers; SymbolName_1: ERJ-PB3D1001V; LibraryName: Res1 1k; DeviceSetName: ERJ-PB3D1001V; DIGI-KEY_PART_NUMBER: P20283CT-ND; MP: ERJ-PB3D1001V; PACKAGE: 1608 Panasonic Electronic Components
U3 U5 = TPS54331GDR: Check prices; GateName_1: A; MF: Texas Instruments; SymbolName_1: TPS54331GDR; LibraryName: TPS54331GDR; DeviceSetName: TPS54331GDR; AVAILABILITY: In Stock; MP: TPS54331GDR; PACKAGE: SOIC-8 Texas Instruments; PRICE: None; PURCHASE-URL: https://pricing.snapeda.com/search/part/TPS54331GDR/?ref=eda

## Sheet STM32_IO.SchDoc
size 374 x 182 mm; Origin: Eagle
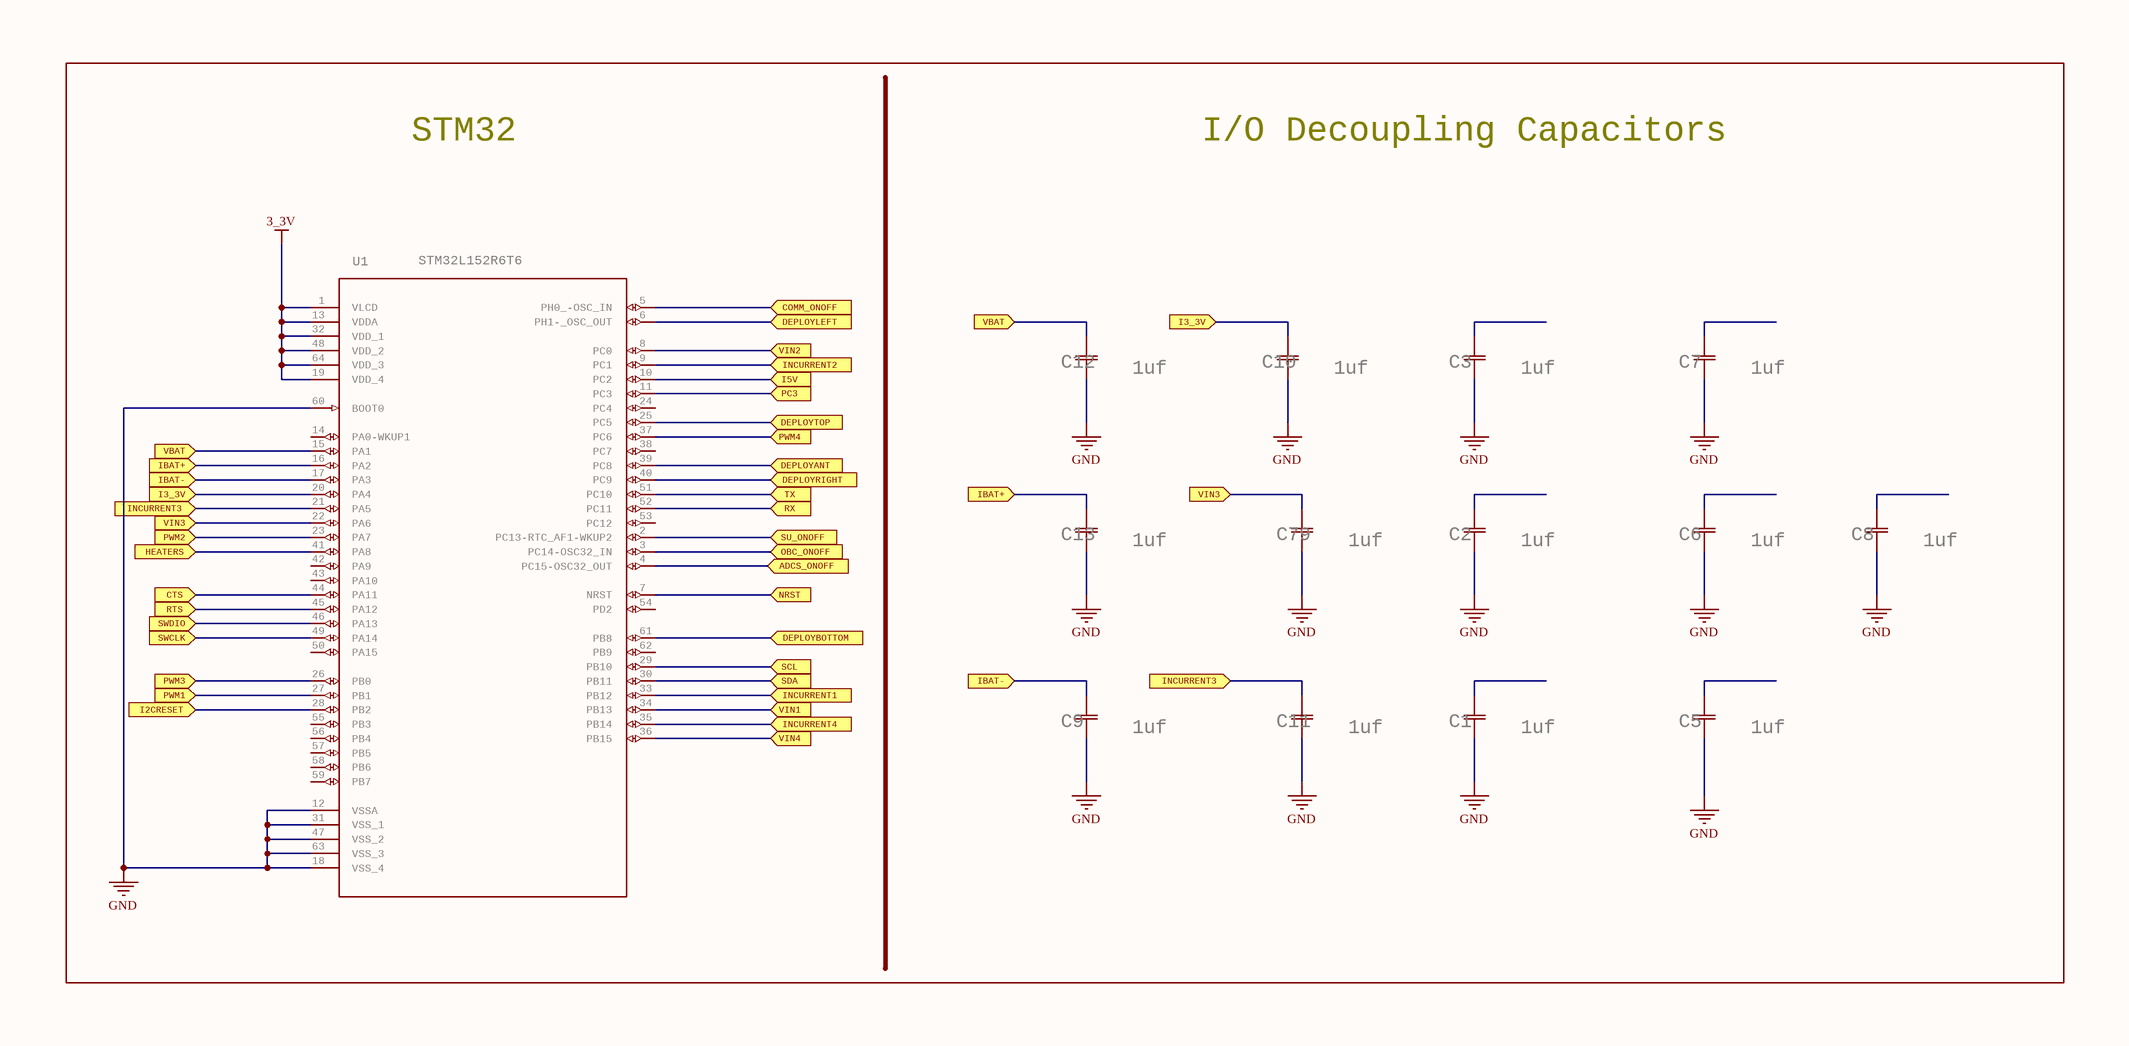
[diagram p16: STM32_IO.SchDoc]

### Parts
C1  1uf  [YAG_CC0603_YAG-L]
C2  1uf  [YAG_CC0603_YAG-L]
C3  1uf  [YAG_CC0603_YAG-L]
C5  1uf  [YAG_CC0603_YAG-L]
C6  1uf  [YAG_CC0603_YAG-L]
C7  1uf  [YAG_CC0603_YAG-L]
C8  1uf  [YAG_CC0603_YAG-L]
C9  1uf  [YAG_CC0603_YAG-L]
C10  1uf  [YAG_CC0603_YAG-L]
C11  1uf  [YAG_CC0603_YAG-L]
C12  1uf  [YAG_CC0603_YAG-L]
C13  1uf  [YAG_CC0603_YAG-L]
C79  1uf  [YAG_CC0603_YAG-L]
U1  STM32L152R6T6  [QFP50P1200X1200X160-64N]

### Ports
ADCS_ONOFF (in), COMM_ONOFF (in), CTS (in), DEPLOYANT (in), DEPLOYBOTTOM (in), DEPLOYLEFT (in), DEPLOYRIGHT (in), DEPLOYTOP (in), HEATERS (in), I2CRESET (in), I3_3V (in), I5V (in), IBAT+ (in), IBAT- (in), INCURRENT1 (in), INCURRENT2 (in), INCURRENT3 (in), INCURRENT4 (in), NRST (in), OBC_ONOFF (in), PC3 (in), PWM1 (in), PWM2 (in), PWM3 (in), PWM4 (in), RTS (in), RX (in), SCL (in), SDA (in), SU_ONOFF (in), SWCLK (in), SWDIO (in), TX (in), VBAT (in), VIN1 (in), VIN2 (in), VIN3 (in), VIN4 (in)

### Nets
3_3V: U1.1(VLCD) U1.13(VDDA) U1.19(VDD_4) U1.32(VDD_1) U1.48(VDD_2) U1.64(VDD_3)
GND: C1.1 C2.1 C3.1 C5.1 C6.1 C7.1 C8.1 C9.1 C10.1 C11.1 C12.1 C13.1 C79.1 U1.12(VSSA) U1.18(VSS_4) U1.31(VSS_1) U1.47(VSS_2) U1.60(BOOT0) U1.63(VSS_3)  [project net BOTTOM]
ADCS_ONOFF: U1.4(PC15-OSC32_OUT) ; port ADCS_ONOFF
COMM_ONOFF: U1.5(PH0_-OSC_IN) ; port COMM_ONOFF
CTS: U1.44(PA11) ; port CTS
DEPLOYANT: U1.39(PC8) ; port DEPLOYANT
DEPLOYBOTTOM: U1.61(PB8) ; port DEPLOYBOTTOM
DEPLOYLEFT: U1.6(PH1-_OSC_OUT) ; port DEPLOYLEFT
DEPLOYRIGHT: U1.40(PC9) ; port DEPLOYRIGHT
DEPLOYTOP: U1.25(PC5) ; port DEPLOYTOP
HEATERS: U1.41(PA8) ; port HEATERS
I2CRESET: U1.28(PB2) ; port I2CRESET
I3_3V: C10.2 U1.20(PA4) ; port I3_3V
I5V: U1.10(PC2) ; port I5V
IBAT+: C13.2 U1.16(PA2) ; port IBAT+
IBAT-: C9.2 U1.17(PA3) ; port IBAT-
INCURRENT1: U1.33(PB12) ; port INCURRENT1
INCURRENT2: U1.9(PC1) ; port INCURRENT2
INCURRENT3: C11.2 U1.21(PA5) ; port INCURRENT3
INCURRENT4: U1.35(PB14) ; port INCURRENT4
NRST: U1.7(NRST) ; port NRST
OBC_ONOFF: U1.3(PC14-OSC32_IN) ; port OBC_ONOFF
PC3: U1.11(PC3) ; port PC3
PWM1: U1.27(PB1) ; port PWM1
PWM2: U1.23(PA7) ; port PWM2
PWM3: U1.26(PB0) ; port PWM3
PWM4: U1.37(PC6) ; port PWM4
RTS: U1.45(PA12) ; port RTS
RX: U1.52(PC11) ; port RX
SCL: U1.29(PB10) ; port SCL
SDA: U1.30(PB11) ; port SDA
SU_ONOFF: U1.2(PC13-RTC_AF1-WKUP2) ; port SU_ONOFF
SWCLK: U1.49(PA14) ; port SWCLK
SWDIO: U1.46(PA13) ; port SWDIO
TX: U1.51(PC10) ; port TX
VBAT: C12.2 U1.15(PA1) ; port VBAT
VIN1: U1.34(PB13) ; port VIN1
VIN2: U1.8(PC0) ; port VIN2
VIN3: C79.2 U1.22(PA6) ; port VIN3
VIN4: U1.36(PB15) ; port VIN4

Not connected (* = marked no-connect by the designer): C1 2; C2 2; C3 2; C5 2; C6 2; C7 2; C8 2; U1 14(PA0-WKUP1) 24(PC4) 38(PC7) 42(PA9) 43(PA10) 50(PA15) 53(PC12) 54(PD2) 55(PB3) 56(PB4) 57(PB5) 58(PB6) 59(PB7) 62(PB9)

### Notes on the sheet
- STM32
- I/O Decoupling Capacitors

### Library data of the parts
C1-C3 C5-C13 C79 = CC0603KRX7R7BB105YAG_CC0603_YAG-L: as C4 on sheet EPS_Headers; DeviceName: YAG_CC0603_YAG-L; LibraryName: Cap 1uf; DeviceSetName: CC0603KRX7R7BB105; MANUFACTURER_PART_NUMBER: CC0603KRX7R7BB105
U1 = STM32L152R6T6: Ultralow power ARM-based 32-bit MCU  Check prices; GateName_1: A; MF: STMicroelectronics; SymbolName_1: STM32L152R6T6; LibraryName: STM32L152R6T6 replace; DeviceSetName: STM32L152R6T6; AVAILABILITY: Not in stock; MP: STM32L152R6T6; PACKAGE: LQFP-64 STMicroelectronics; PRICE: None

## Sheet TEST_SchematicHierarchy.SchDoc
size 96 x 93 mm; Origin: Eagle
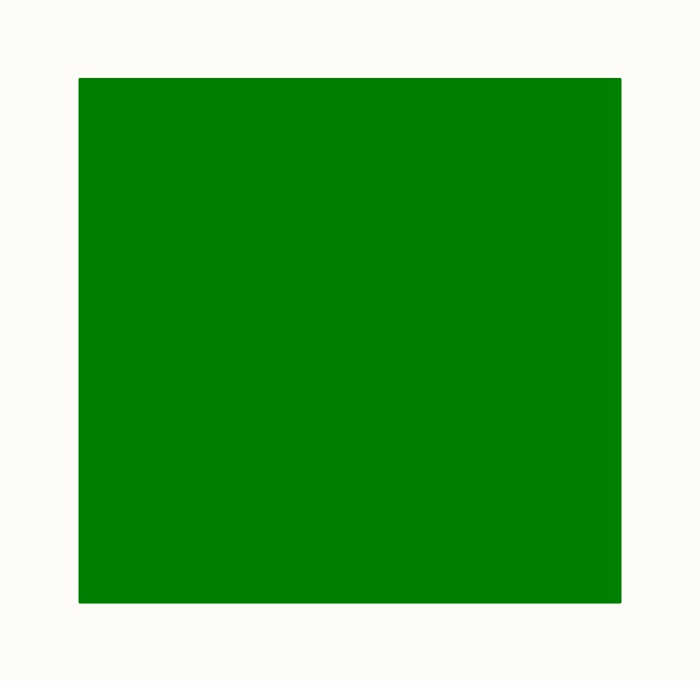
[diagram p17: TEST_SchematicHierarchy.SchDoc]

## Nets that join several sheets
3_3V: EPS_Headers (J1.1 Q17.3 R84.2), Voltage_BypassCapacitors (5 pins), System_VoltageControl (10 pins), STM32_IO (6 pins)
12V: EPS_Headers (IC3.3 IC4.4 IC4.5 R1.2), SolarPanel_PowerGeneration (16 pins), Voltage_BypassCapacitors (12 pins), System_VoltageControl (6 pins)
BOTTOM: EPS_Headers (13 pins), SolarPanel_PowerGeneration (61 pins), Voltage_BypassCapacitors (22 pins), PAH_Deployments (14 pins), System_VoltageControl (78 pins), STM32_IO (19 pins)
VCC: SolarPanel_PowerGeneration (8 pins), PAH_Deployments (19 pins)
DEPLOYANT: PAH_Deployments (R60.1 R61.1), STM32_IO (U1.39)
DEPLOYBOTTOM: PAH_Deployments (R58.2 R59.2), STM32_IO (U1.61)
DEPLOYLEFT: PAH_Deployments (R54.2 R55.2), STM32_IO (U1.6)
DEPLOYRIGHT: PAH_Deployments (R56.2 R57.2), STM32_IO (U1.40)
DEPLOYTOP: PAH_Deployments (R52.2 R53.2), STM32_IO (U1.25)
HEATERS: PAH_Deployments (R62.2 R63.1), STM32_IO (U1.41)
INCURRENT1: SolarPanel_PowerGeneration (IC19.1 R40.2), STM32_IO (U1.33)
INCURRENT2: SolarPanel_PowerGeneration (IC15.1 R30.2), STM32_IO (U1.9)
INCURRENT3: SolarPanel_PowerGeneration (IC11.1 R20.2), STM32_IO (C11.2 U1.21)
INCURRENT4: SolarPanel_PowerGeneration (IC7.1 R10.2), STM32_IO (U1.35)
PWM1: SolarPanel_PowerGeneration (IC20.3 R44.2), STM32_IO (U1.27)
PWM2: SolarPanel_PowerGeneration (IC16.3 R34.2), STM32_IO (U1.23)
PWM3: SolarPanel_PowerGeneration (IC12.3 R24.2), STM32_IO (U1.26)
PWM4: SolarPanel_PowerGeneration (IC8.3 R15.2), STM32_IO (U1.37)
VIN1: SolarPanel_PowerGeneration (R41.1 R42.2), STM32_IO (U1.34)
VIN2: SolarPanel_PowerGeneration (R31.1 R32.2), STM32_IO (U1.8)
VIN3: SolarPanel_PowerGeneration (R21.1 R22.2), STM32_IO (C79.2 U1.22)
VIN4: SolarPanel_PowerGeneration (R11.1 R13.2), STM32_IO (U1.36)